# EAGLE schematic PX4FMUv2.4 (EAGLE 6.4)

## Sheet 1 of 12
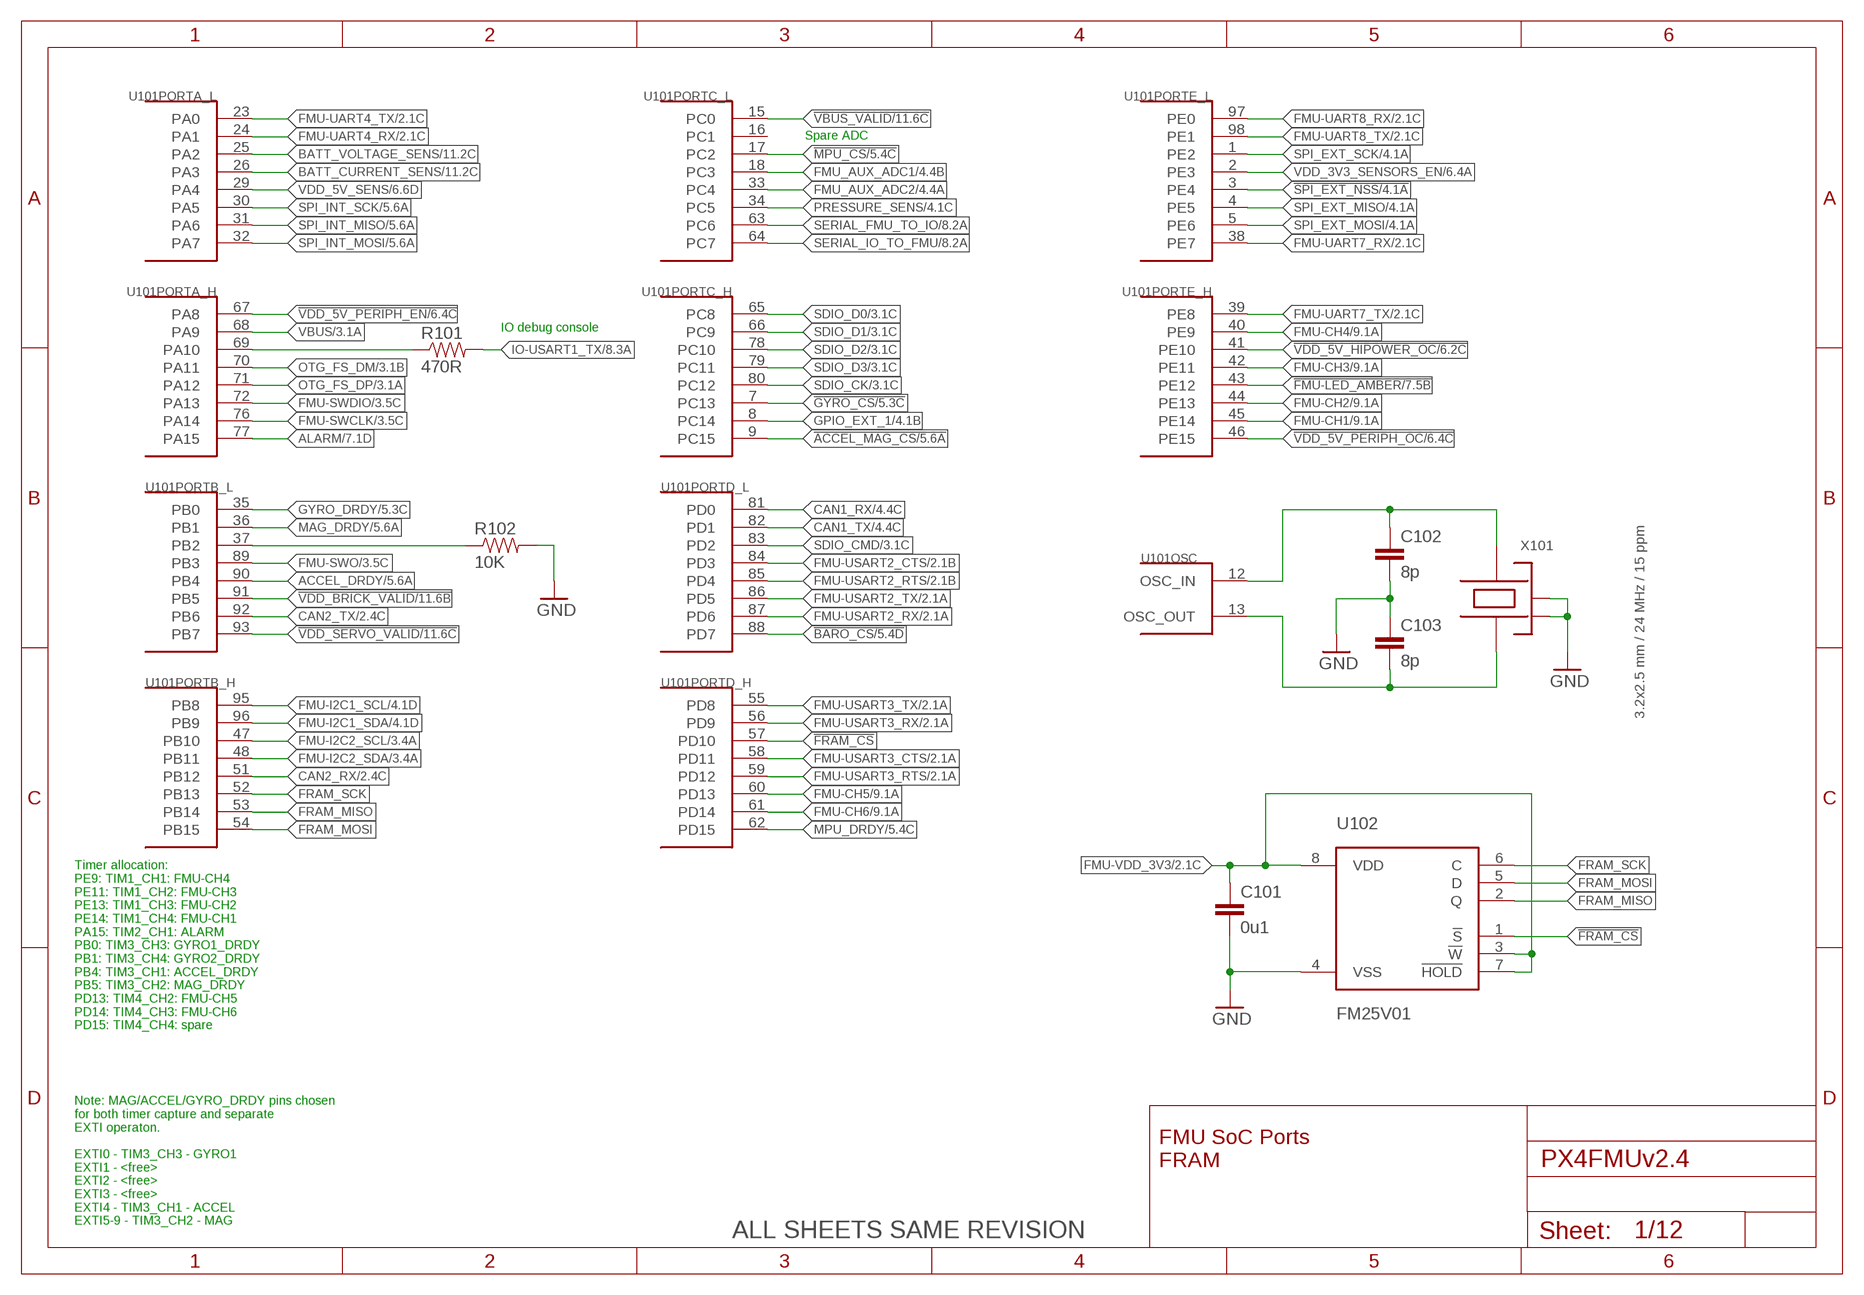
[diagram p0: schematic, sheet 1]

### Parts
C101  0u1  CAP0402  [0402-CAP]
C102  8p  CAP0402  [0402-CAP]
C103  8p  CAP0402  [0402-CAP]
R101  470R  RESISTOR0402-RES  [0402-RES]
R102  10K  RESISTOR0402-RES  [0402-RES]
U101  STM32F4X7VX  [TQFP100]
U102  FM25V01  [SO08]
X101  3.2x2.5 mm / 24 MHz / 15 ppm  OSCILLATOR-3.2X2.5  [OSCILLATOR-3.2X2.5]

### Nets
!ACCEL_MAG_CS: U101.9(PORTC_H:PC15) ; also sheet 5
!BARO_CS: U101.88(PORTD_L:PD7) ; also sheet 5
!FMU-LED_AMBER: U101.43(PORTE_H:PE12) ; also sheet 7
!FRAM_CS: U101.57(PORTD_H:PD10) U102.1(!S)
!GYRO_CS: U101.7(PORTC_H:PC13) ; also sheet 5
!MPU_CS: U101.17(PORTC_L:PC2) ; also sheet 5
!SPI_EXT_NSS: U101.3(PORTE_L:PE4) ; also sheet 4
!VBUS_VALID: U101.15(PORTC_L:PC0) ; also sheet 11,12
!VDD_5V_HIPOWER_OC: U101.41(PORTE_H:PE10) ; also sheet 6
!VDD_5V_PERIPH_EN: U101.67(PORTA_H:PA8) ; also sheet 6
!VDD_5V_PERIPH_OC: U101.46(PORTE_H:PE15) ; also sheet 6
!VDD_BRICK_VALID: U101.91(PORTB_L:PB5) ; also sheet 11,12
!VDD_SERVO_VALID: U101.93(PORTB_L:PB7) ; also sheet 11,12
ACCEL_DRDY: U101.90(PORTB_L:PB4) ; also sheet 5
ALARM: U101.77(PORTA_H:PA15) ; also sheet 7
BATT_CURRENT_SENS: U101.26(PORTA_L:PA3) ; also sheet 11
BATT_VOLTAGE_SENS: U101.25(PORTA_L:PA2) ; also sheet 11
CAN1_RX: U101.81(PORTD_L:PD0) ; also sheet 4
CAN1_TX: U101.82(PORTD_L:PD1) ; also sheet 4
CAN2_RX: U101.51(PORTB_H:PB12) ; also sheet 2
CAN2_TX: U101.92(PORTB_L:PB6) ; also sheet 2
FMU-CH1: U101.45(PORTE_H:PE14) ; also sheet 9
FMU-CH2: U101.44(PORTE_H:PE13) ; also sheet 9
FMU-CH3: U101.42(PORTE_H:PE11) ; also sheet 9
FMU-CH4: U101.40(PORTE_H:PE9) ; also sheet 9
FMU-CH5: U101.60(PORTD_H:PD13) ; also sheet 9
FMU-CH6: U101.61(PORTD_H:PD14) ; also sheet 9
FMU-I2C1_SCL: U101.95(PORTB_H:PB8) ; also sheet 4
FMU-I2C1_SDA: U101.96(PORTB_H:PB9) ; also sheet 4
FMU-I2C2_SCL: U101.47(PORTB_H:PB10) ; also sheet 3,7
FMU-I2C2_SDA: U101.48(PORTB_H:PB11) ; also sheet 3,7
FMU-SWCLK: U101.76(PORTA_H:PA14) ; also sheet 3
FMU-SWDIO: U101.72(PORTA_H:PA13) ; also sheet 3
FMU-SWO: U101.89(PORTB_L:PB3) ; also sheet 3
FMU-UART4_RX: U101.24(PORTA_L:PA1) ; also sheet 2
FMU-UART4_TX: U101.23(PORTA_L:PA0) ; also sheet 2
FMU-UART7_RX: U101.38(PORTE_L:PE7) ; also sheet 2
FMU-UART7_TX: U101.39(PORTE_H:PE8) ; also sheet 2
FMU-UART8_RX: U101.97(PORTE_L:PE0) ; also sheet 2
FMU-UART8_TX: U101.98(PORTE_L:PE1) ; also sheet 2
FMU-USART2_CTS: U101.84(PORTD_L:PD3) ; also sheet 2
FMU-USART2_RTS: U101.85(PORTD_L:PD4) ; also sheet 2
FMU-USART2_RX: U101.87(PORTD_L:PD6) ; also sheet 2
FMU-USART2_TX: U101.86(PORTD_L:PD5) ; also sheet 2
FMU-USART3_CTS: U101.58(PORTD_H:PD11) ; also sheet 2
FMU-USART3_RTS: U101.59(PORTD_H:PD12) ; also sheet 2
FMU-USART3_RX: U101.56(PORTD_H:PD9) ; also sheet 2
FMU-USART3_TX: U101.55(PORTD_H:PD8) ; also sheet 2
FMU-VDD_3V3 [power]: C101.P$1 U102.3(!W) U102.7(!HOLD) U102.8(VDD) ; also sheet 2,3,4,6,7,9,12
FMU_AUX_ADC1: U101.18(PORTC_L:PC3) ; also sheet 4
FMU_AUX_ADC2: U101.33(PORTC_L:PC4) ; also sheet 4
FRAM_MISO: U101.53(PORTB_H:PB14) U102.2(Q)
FRAM_MOSI: U101.54(PORTB_H:PB15) U102.5(D)
FRAM_SCK: U101.52(PORTB_H:PB13) U102.6(C)
GND [power]: C101.P$2 C102.P$2 C103.P$1 R102.P$2 U102.4(VSS) X101.2(NC_2) X101.4(NC_4) ; also sheet 2,3,4,5,6,7,8,9,10,11,12
GPIO_EXT_1: U101.8(PORTC_H:PC14) ; also sheet 4
GYRO_DRDY: U101.35(PORTB_L:PB0) ; also sheet 5
IO-USART1_TX: R101.P$2 ; also sheet 8
MAG_DRDY: U101.36(PORTB_L:PB1) ; also sheet 5
MPU_DRDY [power]: U101.62(PORTD_H:PD15) ; also sheet 5
N$1: C103.P$2 U101.13(OSC:OSC_OUT) X101.1
N$2: C102.P$1 U101.12(OSC:OSC_IN) X101.3
N$23: R101.P$1 U101.69(PORTA_H:PA10)
OTG_FS_DM: U101.70(PORTA_H:PA11) ; also sheet 3
OTG_FS_DP: U101.71(PORTA_H:PA12) ; also sheet 3
PB2-BOOT1: R102.P$1 U101.37(PORTB_L:PB2)
PRESSURE_SENS: U101.34(PORTC_L:PC5) ; also sheet 4
SDIO_CK: U101.80(PORTC_H:PC12) ; also sheet 3
SDIO_CMD: U101.83(PORTD_L:PD2) ; also sheet 3
SDIO_D0: U101.65(PORTC_H:PC8) ; also sheet 3
SDIO_D1: U101.66(PORTC_H:PC9) ; also sheet 3
SDIO_D2: U101.78(PORTC_H:PC10) ; also sheet 3
SDIO_D3: U101.79(PORTC_H:PC11) ; also sheet 3
SERIAL_FMU_TO_IO: U101.63(PORTC_L:PC6) ; also sheet 8
SERIAL_IO_TO_FMU: U101.64(PORTC_L:PC7) ; also sheet 8
SPI_EXT_MISO: U101.4(PORTE_L:PE5) ; also sheet 4
SPI_EXT_MOSI: U101.5(PORTE_L:PE6) ; also sheet 4
SPI_EXT_SCK: U101.1(PORTE_L:PE2) ; also sheet 4
SPI_INT_MISO: U101.31(PORTA_L:PA6) ; also sheet 5
SPI_INT_MOSI: U101.32(PORTA_L:PA7) ; also sheet 5
SPI_INT_SCK: U101.30(PORTA_L:PA5) ; also sheet 5
VBUS [power]: U101.68(PORTA_H:PA9) ; also sheet 3,11,12
VDD_3V3_SENSORS_EN: U101.2(PORTE_L:PE3) ; also sheet 6
VDD_5V_SENS: U101.29(PORTA_L:PA4) ; also sheet 6
Unconnected: U101.16(PORTC_L:PC1)

### Notes on the sheet
- Spare ADC
- IO debug console
- Timer allocation:
  PE9: TIM1_CH1: FMU-CH4
  PE11: TIM1_CH2: FMU-CH3
  PE13: TIM1_CH3: FMU-CH2
  PE14: TIM1_CH4: FMU-CH1
  PA15: TIM2_CH1: ALARM
  PB0: TIM3_CH3: GYRO1_DRDY
  PB1: TIM3_CH4: GYRO2_DRDY
  PB4: TIM3_CH1: ACCEL_DRDY
  PB5: TIM3_CH2: MAG_DRDY
  PD13: TIM4_CH2: FMU-CH5
  PD14: TIM4_CH3: FMU-CH6
  PD15: TIM4_CH4: spare
- FMU SoC Ports
  FRAM
- Note: MAG/ACCEL/GYRO_DRDY pins chosen
  for both timer capture and separate
  EXTI operaton.
  
  EXTI0 - TIM3_CH3 - GYRO1
  EXTI1 - <free>
  EXTI2 - <free>
  EXTI3 - <free>
  EXTI4 - TIM3_CH1 - ACCEL
  EXTI5-9 - TIM3_CH2 - MAG
- ALL SHEETS SAME REVISION

## Sheet 2 of 12
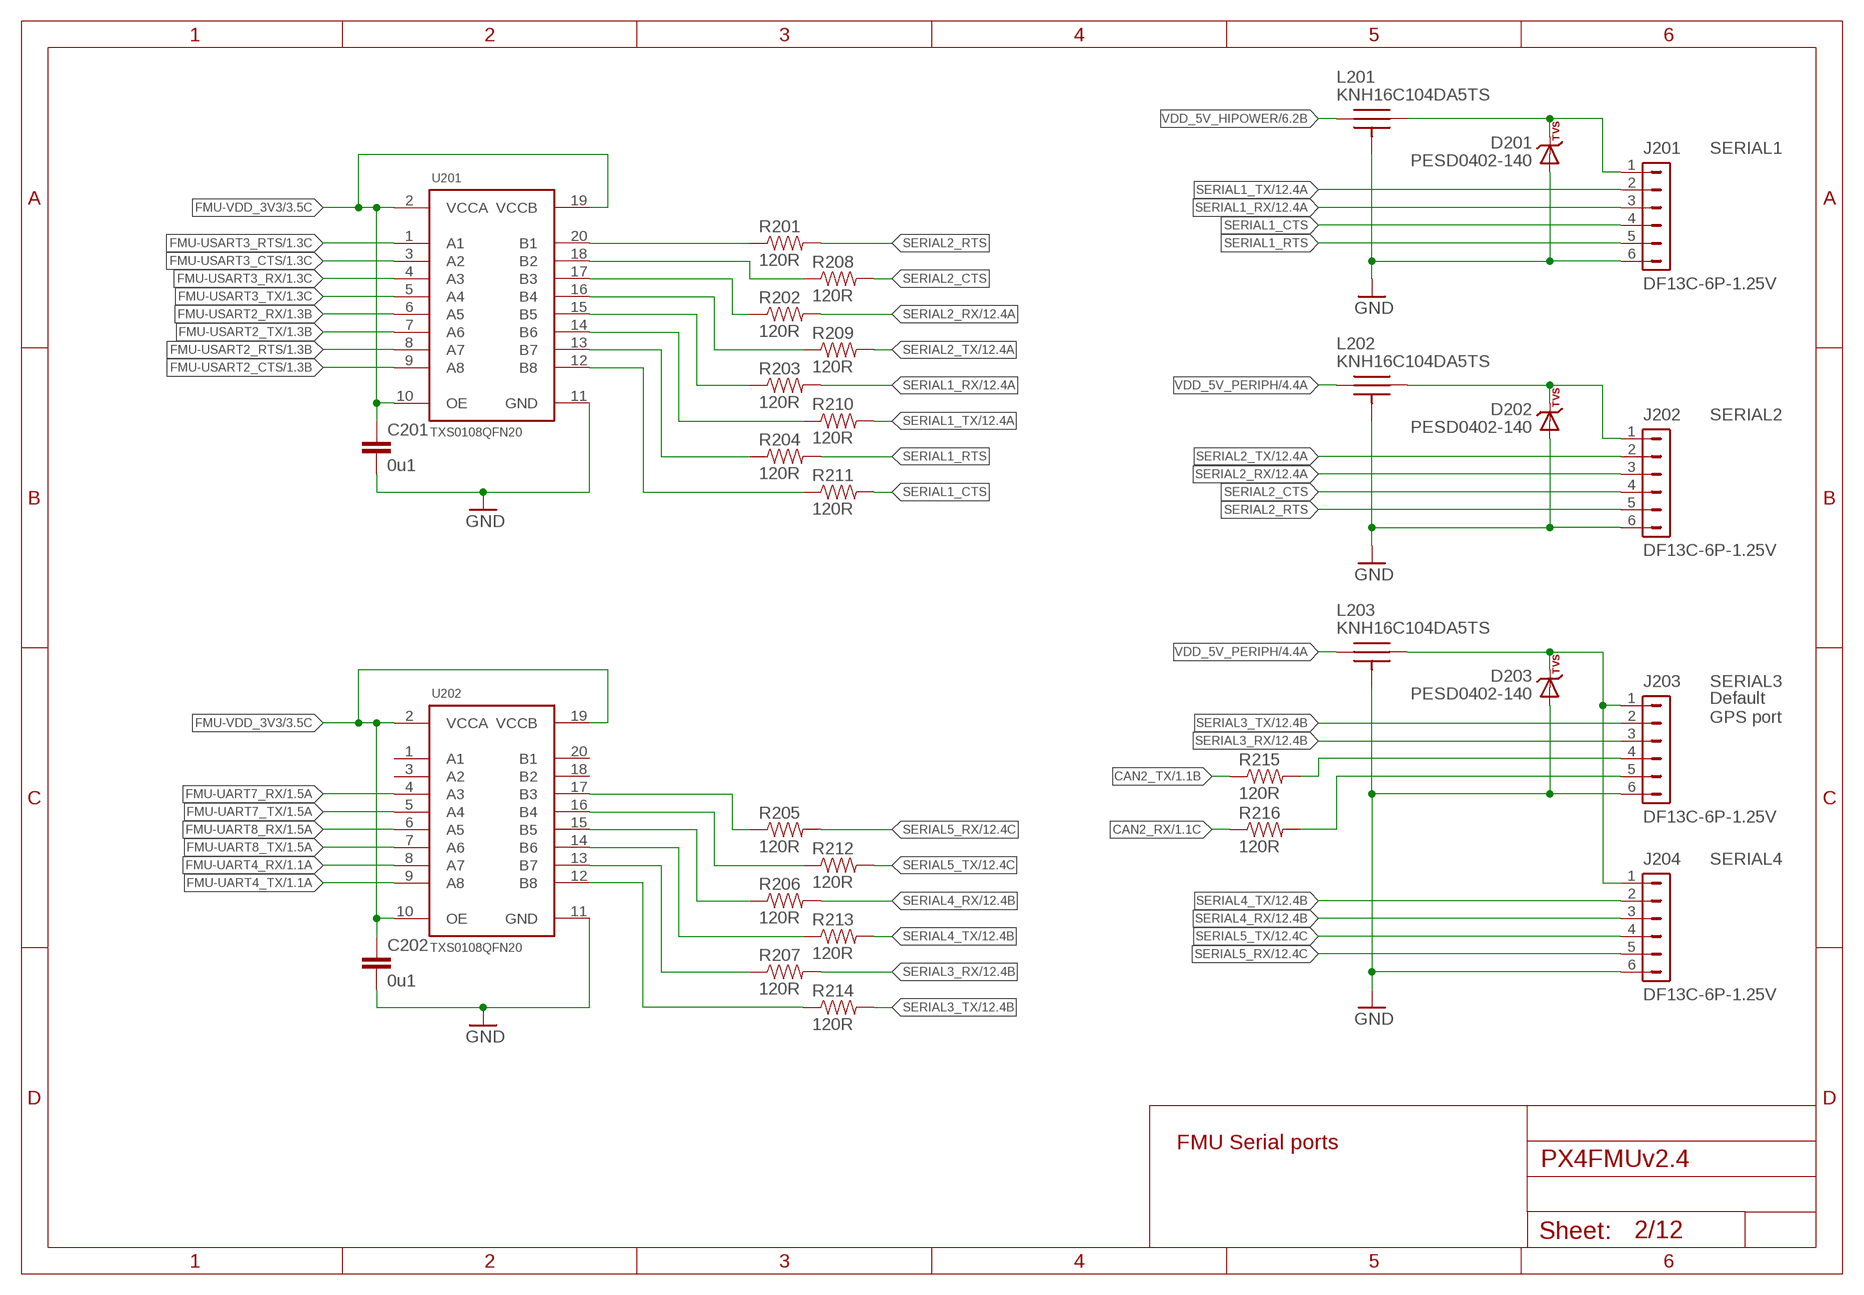
[diagram p1: schematic, sheet 2]

### Parts
C201  0u1  CAP0402  [0402-CAP]
C202  0u1  CAP0402  [0402-CAP]
D201  PESD0402-140  DIODE-TVS  [0402-TVS]
D202  PESD0402-140  DIODE-TVS  [0402-TVS]
D203  PESD0402-140  DIODE-TVS  [0402-TVS]
J201  DF13C-6P-1.25V  DF13-6P-1.25V  [DF13C-6P-1.25V]
J202  DF13C-6P-1.25V  DF13-6P-1.25V  [DF13C-6P-1.25V]
J203  DF13C-6P-1.25V  DF13-6P-1.25V  [DF13C-6P-1.25V]
J204  DF13C-6P-1.25V  DF13-6P-1.25V  [DF13C-6P-1.25V]
L201  KNH16C104DA5TS  [KYOCERA-KNH16-DA]
L202  KNH16C104DA5TS  [KYOCERA-KNH16-DA]
L203  KNH16C104DA5TS  [KYOCERA-KNH16-DA]
R201  120R  RESISTOR0402-RES  [0402-RES]
R202  120R  RESISTOR0402-RES  [0402-RES]
R203  120R  RESISTOR0402-RES  [0402-RES]
R204  120R  RESISTOR0402-RES  [0402-RES]
R205  120R  RESISTOR0402-RES  [0402-RES]
R206  120R  RESISTOR0402-RES  [0402-RES]
R207  120R  RESISTOR0402-RES  [0402-RES]
R208  120R  RESISTOR0402-RES  [0402-RES]
R209  120R  RESISTOR0402-RES  [0402-RES]
R210  120R  RESISTOR0402-RES  [0402-RES]
R211  120R  RESISTOR0402-RES  [0402-RES]
R212  120R  RESISTOR0402-RES  [0402-RES]
R213  120R  RESISTOR0402-RES  [0402-RES]
R214  120R  RESISTOR0402-RES  [0402-RES]
R215  120R  RESISTOR0402-RES  [0402-RES]
R216  120R  RESISTOR0402-RES  [0402-RES]
U201  TXS0108QFN20  [QFN20-RGY]
U202  TXS0108QFN20  [QFN20-RGY]

### Nets
CAN2_RX: R216.P$1 ; also sheet 1
CAN2_TX: R215.P$1 ; also sheet 1
FMU-UART4_RX: U202.8(A7) ; also sheet 1
FMU-UART4_TX: U202.9(A8) ; also sheet 1
FMU-UART7_RX: U202.4(A3) ; also sheet 1
FMU-UART7_TX: U202.5(A4) ; also sheet 1
FMU-UART8_RX: U202.6(A5) ; also sheet 1
FMU-UART8_TX: U202.7(A6) ; also sheet 1
FMU-USART2_CTS: U201.9(A8) ; also sheet 1
FMU-USART2_RTS: U201.8(A7) ; also sheet 1
FMU-USART2_RX: U201.6(A5) ; also sheet 1
FMU-USART2_TX: U201.7(A6) ; also sheet 1
FMU-USART3_CTS: U201.3(A2) ; also sheet 1
FMU-USART3_RTS: U201.1(A1) ; also sheet 1
FMU-USART3_RX: U201.4(A3) ; also sheet 1
FMU-USART3_TX: U201.5(A4) ; also sheet 1
FMU-VDD_3V3 [power]: C201.P$1 C202.P$1 U201.2(VCCA) U201.10(OE) U201.19(VCCB) U202.2(VCCA) U202.10(OE) U202.19(VCCB) ; also sheet 1,3,4,6,7,9,12
GND [power]: C201.P$2 C202.P$2 D201.A D202.A D203.A J201.6 J202.6 J203.6 J204.6 L201.P$3 L201.P$4 L201.P$5 L202.P$3 L202.P$4 L202.P$5 L203.P$3 L203.P$4 L203.P$5 U201.11(GND) U202.11(GND) ; also sheet 1,3,4,5,6,7,8,9,10,11,12
N$5 [power]: D201.C J201.1 L201.P$2
N$14: J203.4 R215.P$2
N$19: J203.5 R216.P$2
N$70: R201.P$1 U201.20(B1)
N$82: R208.P$1 U201.18(B2)
N$83: R202.P$1 U201.17(B3)
N$84: R209.P$1 U201.16(B4)
N$85: R203.P$1 U201.15(B5)
N$86: R210.P$1 U201.14(B6)
N$87: R204.P$1 U201.13(B7)
N$88: R211.P$1 U201.12(B8)
N$89: R207.P$1 U202.13(B7)
N$90: R214.P$1 U202.12(B8)
N$91: R205.P$1 U202.17(B3)
N$92: R212.P$1 U202.16(B4)
N$93: R206.P$1 U202.15(B5)
N$94: R213.P$1 U202.14(B6)
N$100 [power]: D203.C J203.1 J204.1 L203.P$2
N$101 [power]: D202.C J202.1 L202.P$2
SERIAL1_CTS: J201.4 R211.P$2
SERIAL1_RTS: J201.5 R204.P$2
SERIAL1_RX: J201.3 R203.P$2 ; also sheet 12
SERIAL1_TX: J201.2 R210.P$2 ; also sheet 12
SERIAL2_CTS: J202.4 R208.P$2
SERIAL2_RTS: J202.5 R201.P$2
SERIAL2_RX: J202.3 R202.P$2 ; also sheet 12
SERIAL2_TX: J202.2 R209.P$2 ; also sheet 12
SERIAL3_RX: J203.3 R207.P$2 ; also sheet 12
SERIAL3_TX: J203.2 R214.P$2 ; also sheet 12
SERIAL4_RX: J204.3 R206.P$2 ; also sheet 12
SERIAL4_TX: J204.2 R213.P$2 ; also sheet 12
SERIAL5_RX: J204.5 R205.P$2 ; also sheet 12
SERIAL5_TX: J204.4 R212.P$2 ; also sheet 12
VDD_5V_HIPOWER [power]: L201.P$1 ; also sheet 6
VDD_5V_PERIPH [power]: L202.P$1 L203.P$1 ; also sheet 4,6
Unconnected: U202.1(A1) U202.3(A2) U202.18(B2) U202.20(B1)

### Notes on the sheet
- SERIAL1
- SERIAL2
- SERIAL3
- Default 
  GPS port
- SERIAL4
- FMU Serial ports

## Sheet 3 of 12
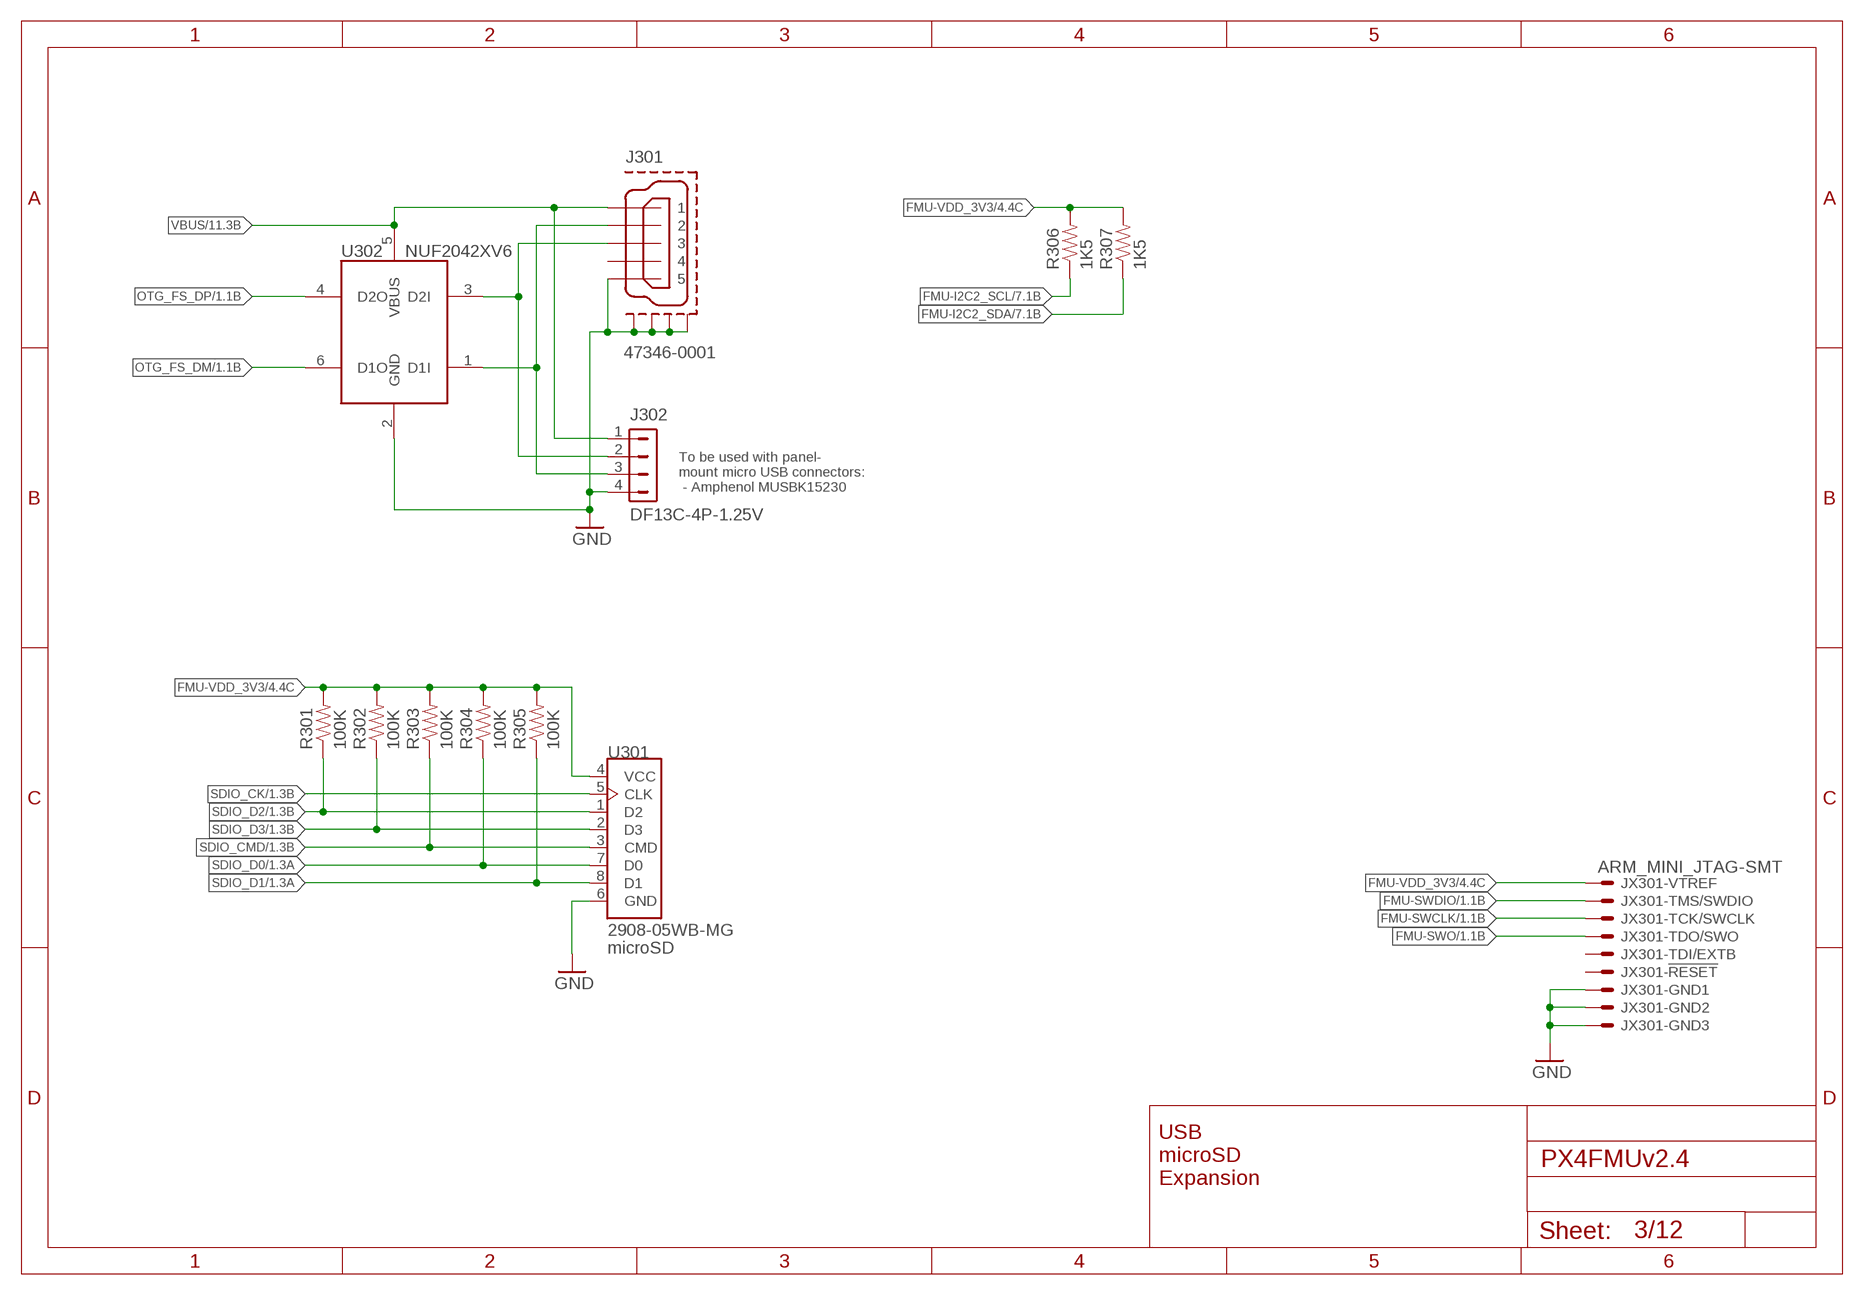
[diagram p2: schematic, sheet 3]

### Parts
J301  47346-0001  MOLEX-47346-0001  [MOLEX-47346-0001]
J302  DF13C-4P-1.25V  DF13-4P-1.25V  [DF13C-4P-1.25V]
JX301  ARM_MINI_JTAG-SMT  [FTSH-105-01-XXX-DV-K]
R301  100K  RESISTOR0402-RES  [0402-RES]
R302  100K  RESISTOR0402-RES  [0402-RES]
R303  100K  RESISTOR0402-RES  [0402-RES]
R304  100K  RESISTOR0402-RES  [0402-RES]
R305  100K  RESISTOR0402-RES  [0402-RES]
R306  1K5  RESISTOR0402-RES  [0402-RES]
R307  1K5  RESISTOR0402-RES  [0402-RES]
U301  2908-05WB-MG  MICROSDSDI  [MICROSD]
U302  NUF2042XV6  [SOT563-6]

### Nets
FMU-I2C2_SCL: R306.P$1 ; also sheet 1,7
FMU-I2C2_SDA: R307.P$1 ; also sheet 1,7
FMU-SWCLK: JX301.4 ; also sheet 1
FMU-SWDIO: JX301.2 ; also sheet 1
FMU-SWO: JX301.6 ; also sheet 1
FMU-VDD_3V3 [power]: JX301.1 R301.P$2 R302.P$2 R303.P$2 R304.P$2 R305.P$2 R306.P$2 R307.P$2 U301.4(VCC) ; also sheet 1,2,4,6,7,9,12
GND [power]: J301.GND J301.GND1 J301.GND2 J301.GND3 J301.GND4 J302.4 JX301.3 JX301.5 JX301.9 U301.6(GND) U302.2(GND) ; also sheet 1,2,4,5,6,7,8,9,10,11,12
OTG_DM1: J301.D- J302.3 U302.1(D1I)
OTG_DP1: J301.D+ J302.2 U302.3(D2I)
OTG_FS_DM: U302.6(D1O) ; also sheet 1
OTG_FS_DP: U302.4(D2O) ; also sheet 1
SDIO_CK: U301.5(CLK) ; also sheet 1
SDIO_CMD: R303.P$1 U301.3(CMD) ; also sheet 1
SDIO_D0: R304.P$1 U301.7(D0) ; also sheet 1
SDIO_D1: R305.P$1 U301.8(D1) ; also sheet 1
SDIO_D2: R301.P$1 U301.1(D2) ; also sheet 1
SDIO_D3: R302.P$1 U301.2(D3) ; also sheet 1
VBUS [power]: J301.VBUS J302.1 U302.5(VBUS) ; also sheet 1,11,12
Unconnected: J301.ID JX301.8 JX301.10

### Notes on the sheet
- To be used with panel-
  mount micro USB connectors:
   - Amphenol MUSBK15230
- microSD
- USB
  microSD
  Expansion

## Sheet 4 of 12
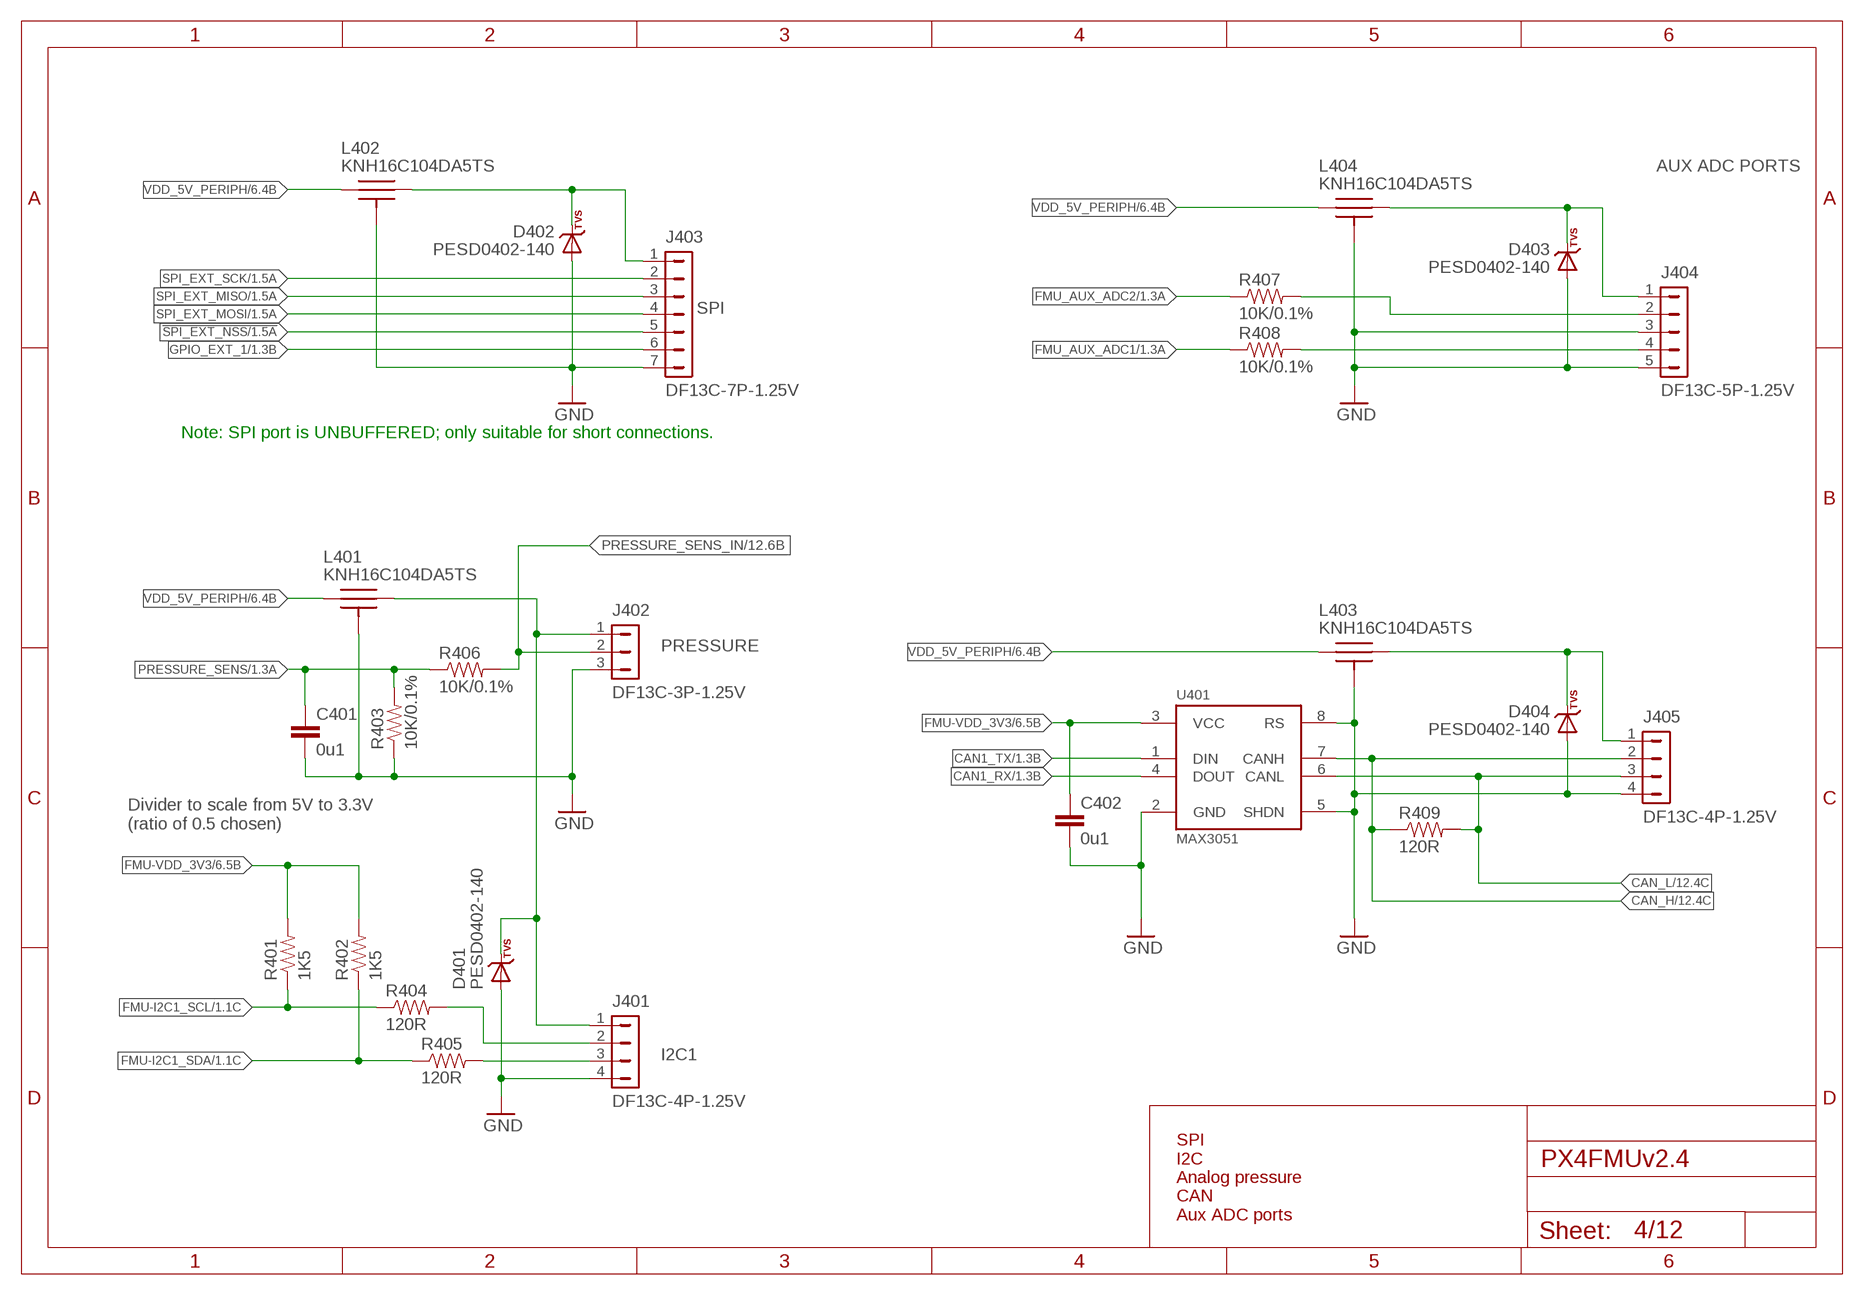
[diagram p3: schematic, sheet 4]

### Parts
C401  0u1  CAP0402  [0402-CAP]
C402  0u1  CAP0402  [0402-CAP]
D401  PESD0402-140  DIODE-TVS  [0402-TVS]
D402  PESD0402-140  DIODE-TVS  [0402-TVS]
D403  PESD0402-140  DIODE-TVS  [0402-TVS]
D404  PESD0402-140  DIODE-TVS  [0402-TVS]
J401  DF13C-4P-1.25V  DF13-4P-1.25V  [DF13C-4P-1.25V]
J402  DF13C-3P-1.25V  DF13-3P-1.25V  [DF13C-3P-1.25V]
J403  DF13C-7P-1.25V  DF13-7P-1.25V  [DF13C-7P-1.25V]
J404  DF13C-5P-1.25V  DF13-5P-1.25V  [DF13C-5P-1.25V]
J405  DF13C-4P-1.25V  DF13-4P-1.25V  [DF13C-4P-1.25V]
L401  KNH16C104DA5TS  [KYOCERA-KNH16-DA]
L402  KNH16C104DA5TS  [KYOCERA-KNH16-DA]
L403  KNH16C104DA5TS  [KYOCERA-KNH16-DA]
L404  KNH16C104DA5TS  [KYOCERA-KNH16-DA]
R401  1K5  RESISTOR0402-RES  [0402-RES]
R402  1K5  RESISTOR0402-RES  [0402-RES]
R403  10K/0.1%  RESISTOR0402-RES  [0402-RES]
R404  120R  RESISTOR0402-RES  [0402-RES]
R405  120R  RESISTOR0402-RES  [0402-RES]
R406  10K/0.1%  RESISTOR0402-RES  [0402-RES]
R407  10K/0.1%  RESISTOR0402-RES  [0402-RES]
R408  10K/0.1%  RESISTOR0402-RES  [0402-RES]
R409  120R  RESISTOR0402-RES  [0402-RES]
U401  MAX3051  MAX3051MAX3051EKA  [SOT23-8]

### Nets
!SPI_EXT_NSS: J403.5 ; also sheet 1
CAN1_RX: U401.4(DOUT) ; also sheet 1
CAN1_TX: U401.1(DIN) ; also sheet 1
CAN_H: J405.2 R409.P$1 U401.7(CANH) ; also sheet 12
CAN_L: J405.3 R409.P$2 U401.6(CANL) ; also sheet 12
FMU-I2C1_SCL: R401.P$1 R404.P$1 ; also sheet 1
FMU-I2C1_SDA: R402.P$1 R405.P$1 ; also sheet 1
FMU-VDD_3V3 [power]: C402.P$1 R401.P$2 R402.P$2 U401.3(VCC) ; also sheet 1,2,3,6,7,9,12
FMU_AUX_ADC1: R408.P$1 ; also sheet 1
FMU_AUX_ADC1_PROT: J404.4 R408.P$2
FMU_AUX_ADC2: R407.P$1 ; also sheet 1
FMU_AUX_ADC2_PROT: J404.2 R407.P$2
GND [power]: C401.P$2 C402.P$2 D401.A D402.A D403.A D404.A J401.4 J402.3 J403.7 J404.3 J404.5 J405.4 L401.P$3 L401.P$4 L401.P$5 L402.P$3 L402.P$4 L402.P$5 L403.P$3 L403.P$4 L403.P$5 L404.P$3 L404.P$4 L404.P$5 R403.P$1 U401.2(GND) U401.5(SHDN) U401.8(RS) ; also sheet 1,2,3,5,6,7,8,9,10,11,12
GPIO_EXT_1: J403.6 ; also sheet 1
N$33: J401.2 R404.P$2
N$37: J401.3 R405.P$2
N$41 [power]: D402.C J403.1 L402.P$2
N$42 [power]: D401.C J401.1 J402.1 L401.P$2
N$48 [power]: D404.C J405.1 L403.P$2
N$98 [power]: D403.C J404.1 L404.P$2
PRESSURE_SENS: C401.P$1 R403.P$2 R406.P$1 ; also sheet 1
PRESSURE_SENS_IN: J402.2 R406.P$2 ; also sheet 12
SPI_EXT_MISO: J403.3 ; also sheet 1
SPI_EXT_MOSI: J403.4 ; also sheet 1
SPI_EXT_SCK: J403.2 ; also sheet 1
VDD_5V_PERIPH [power]: L401.P$1 L402.P$1 L403.P$1 L404.P$1 ; also sheet 2,6

### Notes on the sheet
- AUX ADC PORTS
- SPI
- Note: SPI port is UNBUFFERED; only suitable for short connections.
- PRESSURE
- Divider to scale from 5V to 3.3V
  (ratio of 0.5 chosen)
- I2C1
- SPI
  I2C
  Analog pressure
  CAN
  Aux ADC ports

## Sheet 5 of 12
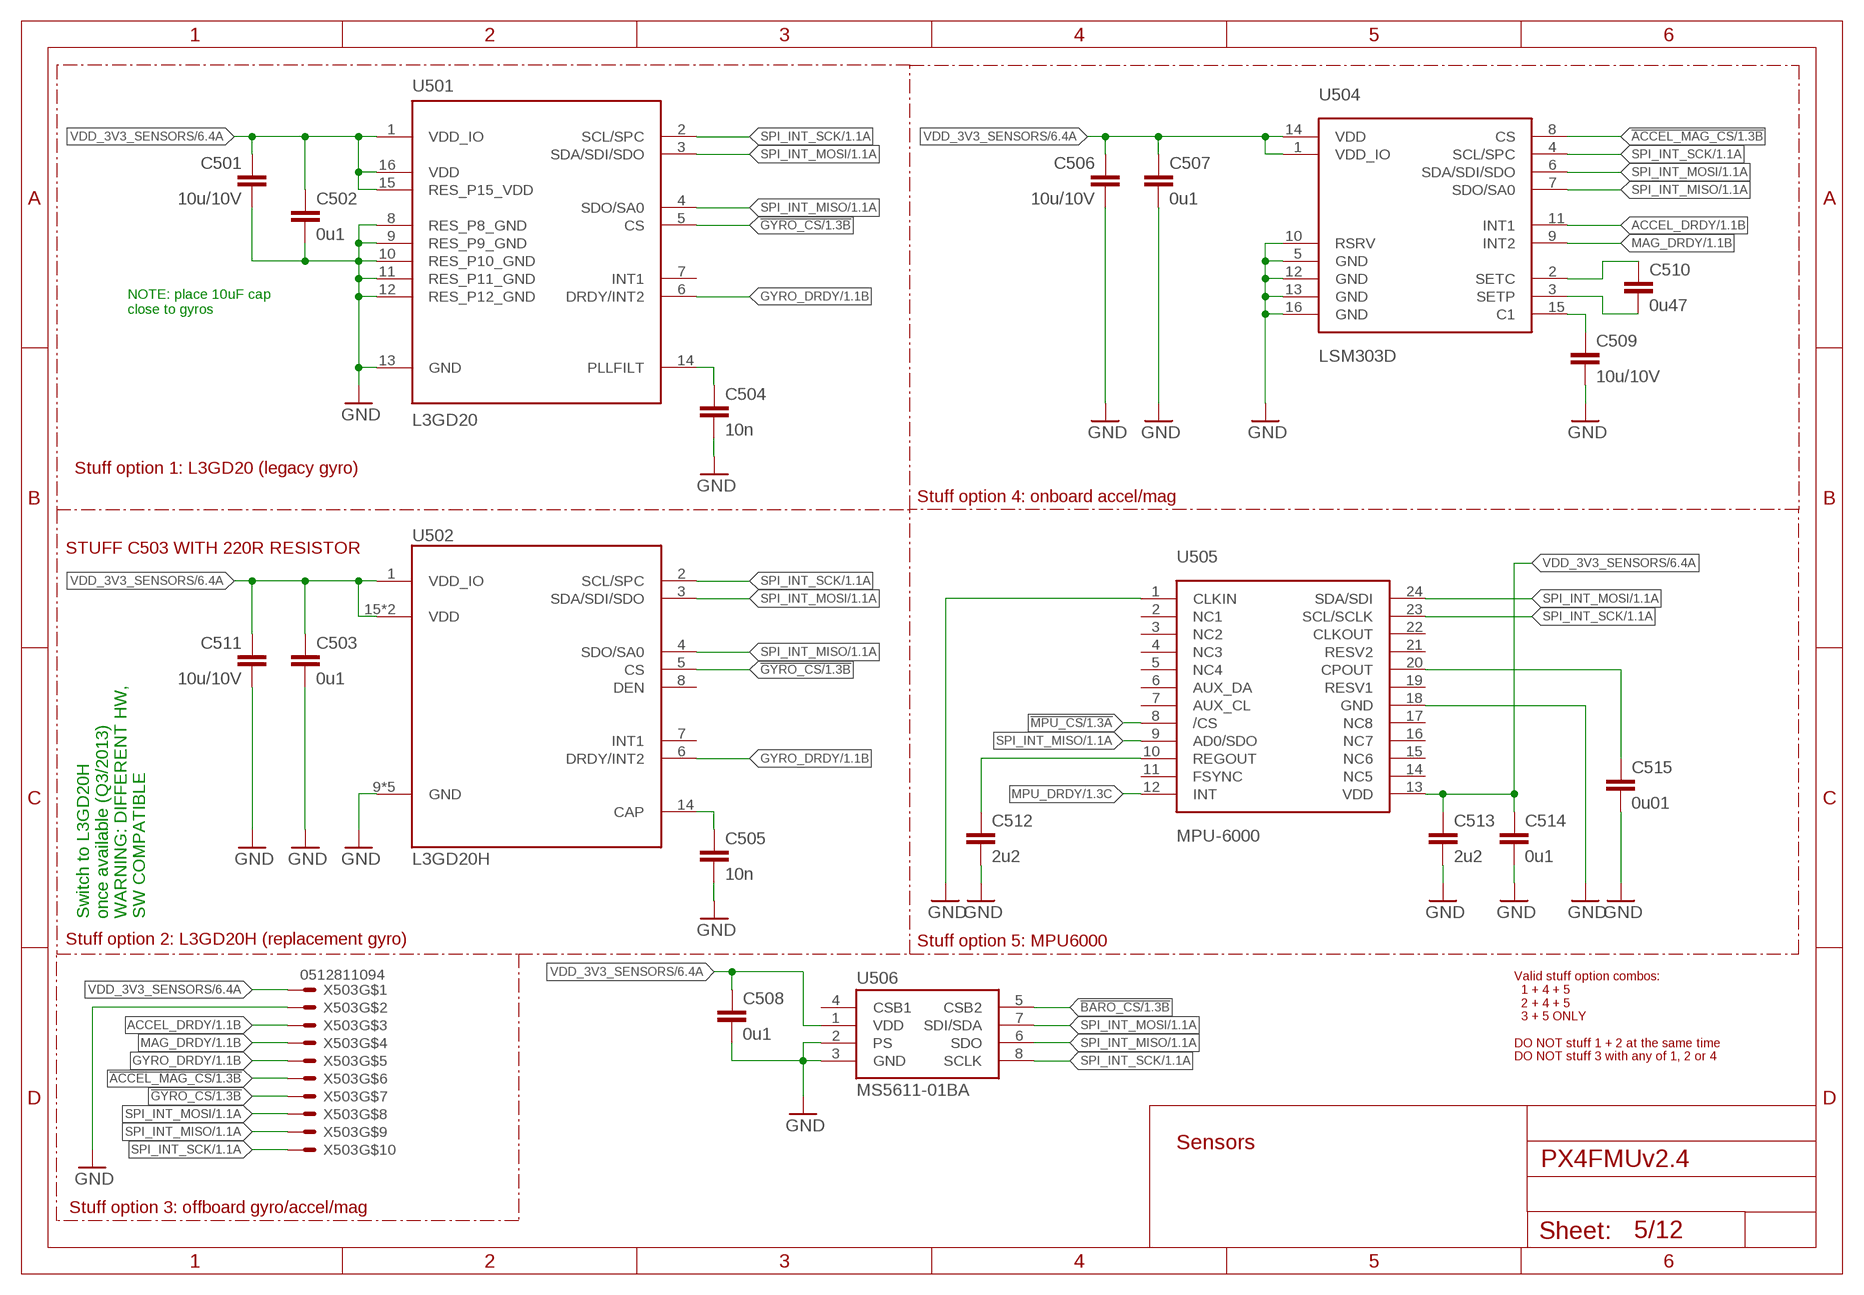
[diagram p4: schematic, sheet 5]

### Parts
C501  10u/10V  CAP0805  [0805-CAP]
C502  0u1  CAP0402  [0402-CAP]
C503  0u1  CAP0402  [0402-CAP]
C504  10n  CAP0402  [0402-CAP]
C505  10n  CAP0402  [0402-CAP]
C506  10u/10V  CAP0805  [0805-CAP]
C507  0u1  CAP0402  [0402-CAP]
C508  0u1  CAP0402  [0402-CAP]
C509  10u/10V  CAP0805  [0805-CAP]
C510  0u47  CAP0402  [0402-CAP]
C511  10u/10V  CAP0805  [0805-CAP]
C512  2u2  CAP0603  [0603-CAP]
C513  2u2  CAP0603  [0603-CAP]
C514  0u1  CAP0402  [0402-CAP]
C515  0u01  CAP0603  [0603-CAP]
U501  L3GD20  L3G4200DH-LL  [L3G4200DH-MAN]
U502  L3GD20H  [LGA-16L]
U504  LSM303D  [LGA-16L]
U505  MPU-6000  [QFN-24]
U506  MS5611-01BA  [MS5611-01BA]
X503  0512811094  CONN_FPC_10RA  [51281-1094]

### Nets
!ACCEL_MAG_CS: U504.8(CS) X503.6 ; also sheet 1
!BARO_CS: U506.5(CSB2) ; also sheet 1
!GYRO_CS: U501.5(CS) U502.5(CS) X503.7 ; also sheet 1
!MPU_CS: U505.8(/CS) ; also sheet 1
ACCEL_DRDY: U504.11(INT1) X503.3 ; also sheet 1
GND [power]: C501.P$2 C502.P$2 C503.P$2 C504.P$2 C505.P$2 C506.P$2 C507.P$2 C508.P$2 C509.P$2 C511.P$2 C512.P$2 C513.P$2 C514.P$2 C515.P$2 U501.8(RES_P8_GND) U501.9(RES_P9_GND) U501.10(RES_P10_GND) U501.11(RES_P11_GND) U501.12(RES_P12_GND) U501.13(GND) U502.9(GND) U502.10(GND) U502.11(GND) U502.12(GND) U502.13(GND) U504.5(GND) U504.10(RSRV) U504.12(GND) U504.13(GND) U504.16(GND) U505.1(CLKIN) U505.18(GND) U506.2(PS) U506.3(GND) X503.2 ; also sheet 1,2,3,4,6,7,8,9,10,11,12
GYRO_DRDY: U501.6(DRDY/INT2) U502.6(DRDY/INT2) X503.5 ; also sheet 1
MAG_DRDY: U504.9(INT2) X503.4 ; also sheet 1
MPU_DRDY [power]: U505.12(INT) ; also sheet 1
N$6: C509.P$1 U504.15(C1)
N$10: C510.P$1 U504.2(SETC)
N$17: C510.P$2 U504.3(SETP)
N$30: C505.P$1 U502.14(CAP)
N$35: C504.P$1 U501.14(PLLFILT)
N$50: C512.P$1 U505.10(REGOUT)
N$51: C515.P$1 U505.20(CPOUT)
SPI_INT_MISO: U501.4(SDO/SA0) U502.4(SDO/SA0) U504.7(SDO/SA0) U505.9(AD0/SDO) U506.6(SDO) X503.9 ; also sheet 1
SPI_INT_MOSI: U501.3(SDA/SDI/SDO) U502.3(SDA/SDI/SDO) U504.6(SDA/SDI/SDO) U505.24(SDA/SDI) U506.7(SDI/SDA) X503.8 ; also sheet 1
SPI_INT_SCK: U501.2(SCL/SPC) U502.2(SCL/SPC) U504.4(SCL/SPC) U505.23(SCL/SCLK) U506.8(SCLK) X503.10 ; also sheet 1
VDD_3V3_SENSORS [power]: C501.P$1 C502.P$1 C503.P$1 C506.P$1 C507.P$1 C508.P$1 C511.P$1 C513.P$1 C514.P$1 U501.1(VDD_IO) U501.15(RES_P15_VDD) U501.16(VDD) U502.1(VDD_IO) U502.15(VDD) U502.16(VDD) U504.1(VDD_IO) U504.14(VDD) U505.13(VDD) U506.1(VDD) X503.1 ; also sheet 6,12
Unconnected: U501.7(INT1) U502.7(INT1) U502.8(DEN) U505.2(NC1) U505.3(NC2) U505.4(NC3) U505.5(NC4) U505.6(AUX_DA) U505.7(AUX_CL) U505.11(FSYNC) U505.14(NC5) U505.15(NC6) U505.16(NC7) U505.17(NC8) U505.19(RESV1) U505.21(RESV2) U505.22(CLKOUT) U506.4(CSB1)

### Notes on the sheet
- NOTE: place 10uF cap
  close to gyros
- Stuff option 1: L3GD20 (legacy gyro)
- Stuff option 4: onboard accel/mag
- STUFF C503 WITH 220R RESISTOR
- Switch to L3GD20H
  once available (Q3/2013)
  WARNING: DIFFERENT HW,
  SW COMPATIBLE
- Stuff option 2: L3GD20H (replacement gyro) | Stuff option 5: MPU6000
- Valid stuff option combos:
    1 + 4 + 5
    2 + 4 + 5
    3 + 5 ONLY
  
  DO NOT stuff 1 + 2 at the same time
  DO NOT stuff 3 with any of 1, 2 or 4
- Sensors
- Stuff option 3: offboard gyro/accel/mag

## Sheet 6 of 12
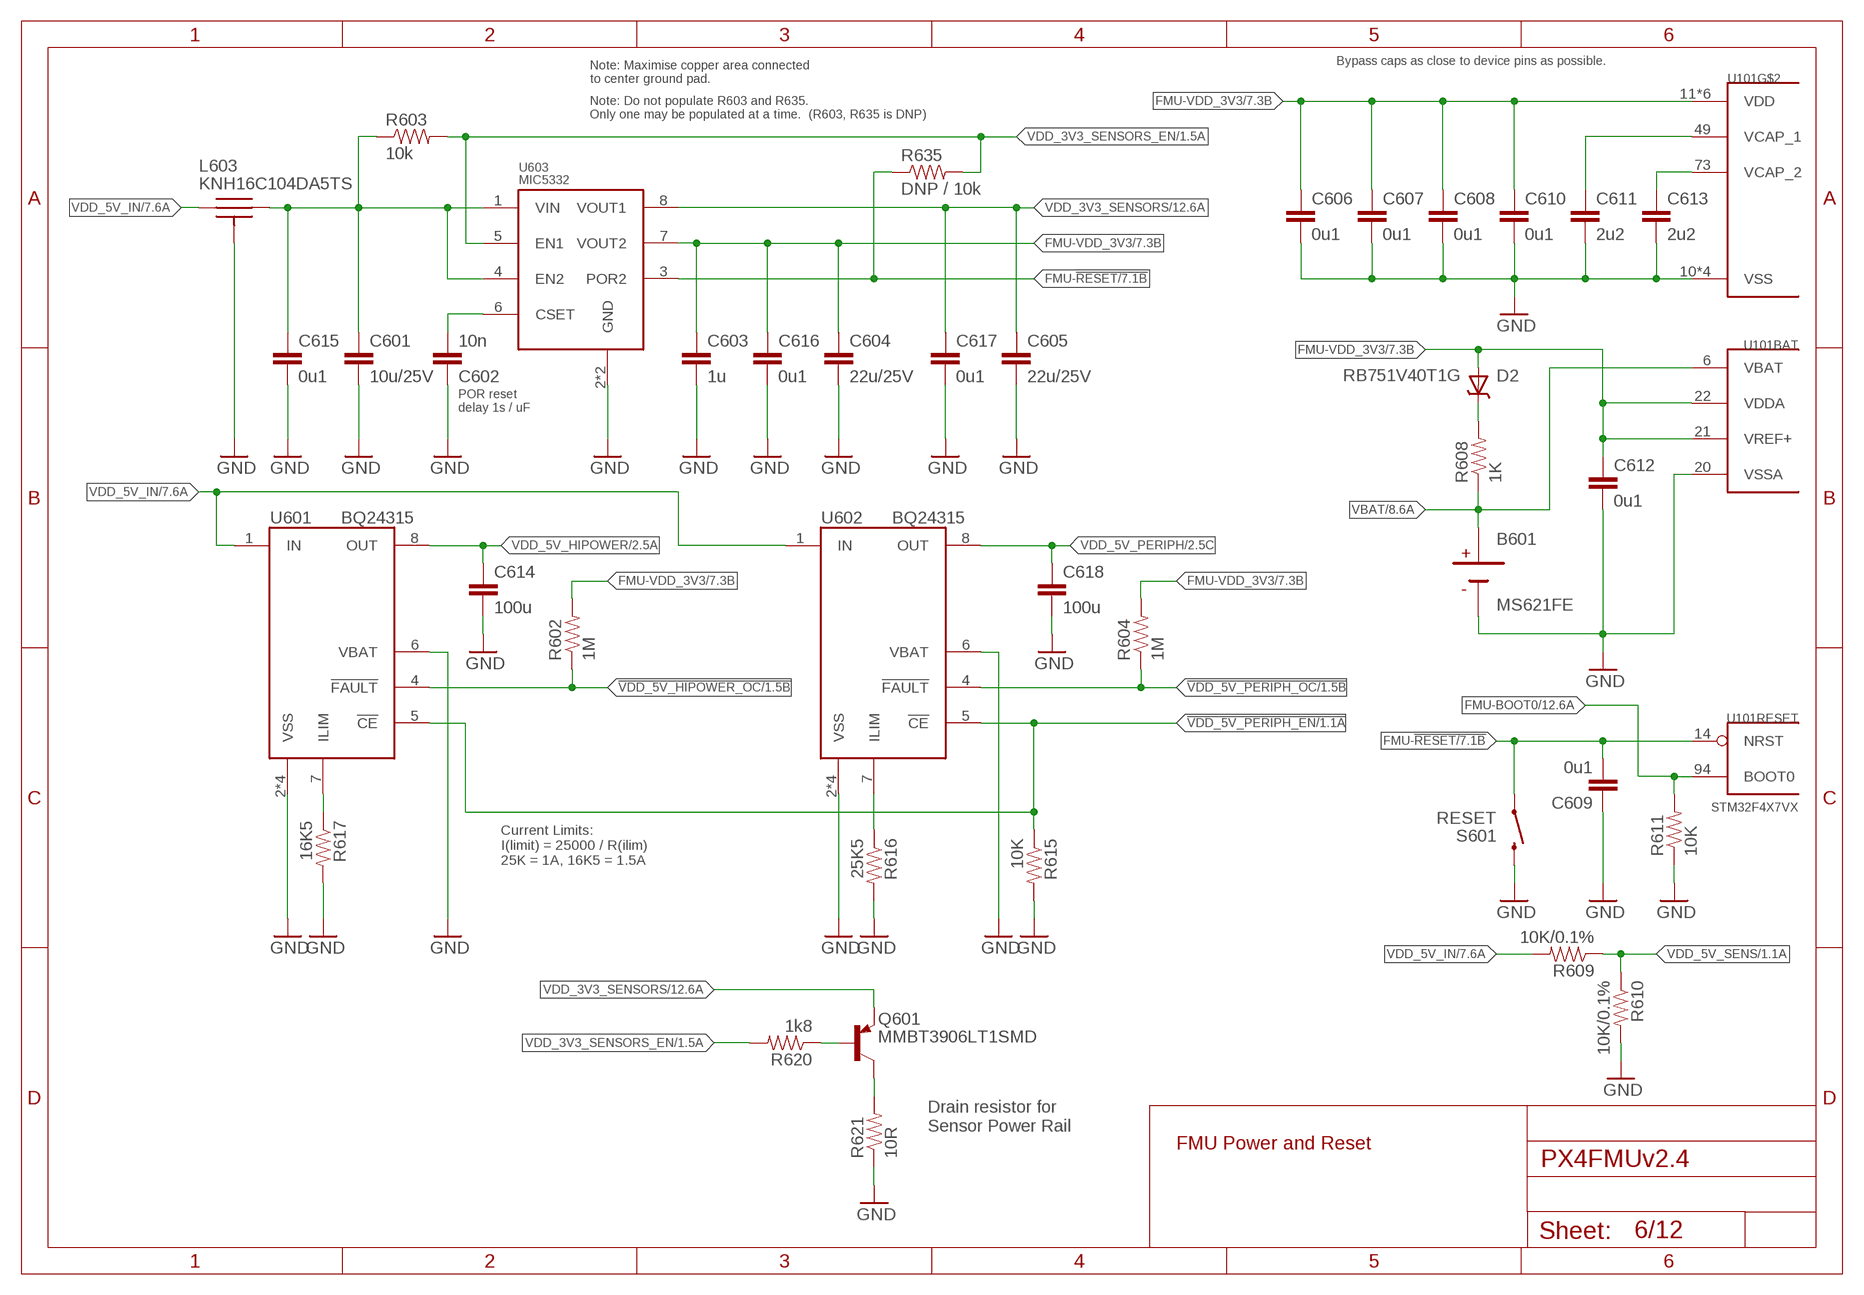
[diagram p5: schematic, sheet 6]

### Parts
B601  MS621FE  [MS621FE]
C601  10u/25V  CAP0805  [0805-CAP]
C602  10n  CAP0402  [0402-CAP]
C603  1u  CAP0603  [0603-CAP]
C604  22u/25V  CAP0805  [0805-CAP]
C605  22u/25V  CAP0805  [0805-CAP]
C606  0u1  CAP0402  [0402-CAP]
C607  0u1  CAP0402  [0402-CAP]
C608  0u1  CAP0402  [0402-CAP]
C609  0u1  CAP0402  [0402-CAP]
C610  0u1  CAP0402  [0402-CAP]
C611  2u2  CAP0603  [0603-CAP]
C612  0u1  CAP0402  [0402-CAP]
C613  2u2  CAP0603  [0603-CAP]
C614  100u  CAP1206  [1206-CAP]
C615  0u1  CAP0402  [0402-CAP]
C616  0u1  CAP0402  [0402-CAP]
C617  0u1  CAP0402  [0402-CAP]
C618  100u  CAP1206  [1206-CAP]
D2  RB751V40T1G  DIODE-SCHOTTKY_SOD323  [SOD323]
L603  KNH16C104DA5TS  [KYOCERA-KNH16-DA]
Q601  MMBT3906LT1SMD  [SOT23-BEC]
R602  1M  RESISTOR0402-RES  [0402-RES]
R603  10k  RESISTOR0402-RES  [0402-RES]
R604  1M  RESISTOR0402-RES  [0402-RES]
R608  1K  RESISTOR0402-RES  [0402-RES]
R609  10K/0.1%  RESISTOR0402-RES  [0402-RES]
R610  10K/0.1%  RESISTOR0402-RES  [0402-RES]
R611  10K  RESISTOR0402-RES  [0402-RES]
R615  10K  RESISTOR0402-RES  [0402-RES]
R616  25K5  RESISTOR0402-RES  [0402-RES]
R617  16K5  RESISTOR0402-RES  [0402-RES]
R620  1k8  RESISTOR0402-RES  [0402-RES]
R621  10R  RESISTOR0603-RES  [0603-RES]
R635  DNP / 10k  RESISTOR0402-RES  [0402-RES]
S601  RESET  SWITCH-MOMENTARY-2  [EVQP7J01K]
U601  BQ24315  [QFN8-DSG]
U602  BQ24315  [QFN8-DSG]
U603  MIC5332  [MLF-8-EPAD]

### Nets
!VDD_5V_HIPOWER_OC: R602.P$1 U601.4(!FAULT) ; also sheet 1
!VDD_5V_PERIPH_EN: R615.P$1 U601.5(!CE) U602.5(!CE) ; also sheet 1
!VDD_5V_PERIPH_OC: R604.P$1 U602.4(!FAULT) ; also sheet 1
FMU-!RESET: C609.P$2 R635.P$1 S601.A1 U101.14(RESET:NRST) U603.3(POR2) ; also sheet 7
FMU-BOOT0: R611.P$2 U101.94(RESET:BOOT0) ; also sheet 12
FMU-VDD_3V3 [power]: C603.P$1 C604.P$1 C606.P$1 C607.P$1 C608.P$1 C610.P$1 C612.P$1 C616.P$1 D2.A R602.P$2 R604.P$2 U101.11(VDD) U101.19(VDD) U101.21(BAT:VREF+) U101.22(BAT:VDDA) U101.28(VDD) U101.50(VDD) U101.75(VDD) U101.100(VDD) U603.7(VOUT2) ; also sheet 1,2,3,4,7,9,12
FMU-VDD_5V5 [power]: C601.P$1 C615.P$1 L603.P$2 R603.P$1 U603.1(VIN) U603.4(EN2)
GND [power]: B601.2(NEG) C601.P$2 C602.P$1 C603.P$2 C604.P$2 C605.P$2 C606.P$2 C607.P$2 C608.P$2 C609.P$1 C610.P$2 C611.P$2 C612.P$2 C613.P$2 C614.P$2 C615.P$2 C616.P$2 C617.P$2 C618.P$2 L603.P$3 L603.P$4 L603.P$5 R610.P$2 R611.P$1 R615.P$2 R616.P$2 R617.P$2 R621.1 S601.B3 U101.10(VSS) U101.20(BAT:VSSA) U101.27(VSS) U101.74(VSS) U101.99(VSS) U601.2(VSS) U601.6(VBAT) U601.GND(VSS) U601.P$2(VSS) U601.P$3(VSS) U602.2(VSS) U602.6(VBAT) U602.GND(VSS) U602.P$2(VSS) U602.P$3(VSS) U603.2(GND) U603.GND ; also sheet 1,2,3,4,5,7,8,9,10,11,12
N$8: C613.P$1 U101.73(VCAP_2)
N$11: C602.P$2 U603.6(CSET)
N$12: C611.P$1 U101.49(VCAP_1)
N$21: D2.C R608.P$2
N$34: R616.P$1 U602.7(ILIM)
N$80: Q601.C R621.2
N$81: Q601.B R620.P$1
N$96: R617.P$1 U601.7(ILIM)
VBAT: B601.1(POS) R608.P$1 U101.6(BAT:VBAT) ; also sheet 8
VDD_3V3_SENSORS [power]: C605.P$1 C617.P$1 Q601.E U603.8(VOUT1) ; also sheet 5,12
VDD_3V3_SENSORS_EN: R603.P$2 R620.P$2 R635.P$2 U603.5(EN1) ; also sheet 1
VDD_5V_HIPOWER [power]: C614.P$1 U601.8(OUT) ; also sheet 2
VDD_5V_IN [power]: L603.P$1 R609.P$2 U601.1(IN) U602.1(IN) ; also sheet 7,10,11,12
VDD_5V_PERIPH [power]: C618.P$1 U602.8(OUT) ; also sheet 2,4
VDD_5V_SENS: R609.P$1 R610.P$1 ; also sheet 1

### Notes on the sheet
- Bypass caps as close to device pins as possible.
- Note: Maximise copper area connected 
  to center ground pad.
- Note: Do not populate R603 and R635.  
  Only one may be populated at a time.  (R603, R635 is DNP)
- POR reset 
  delay 1s / uF
- Current Limits:
  I(limit) = 25000 / R(ilim)
  25K = 1A, 16K5 = 1.5A
- Drain resistor for 
  Sensor Power Rail
- FMU Power and Reset

## Sheet 7 of 12
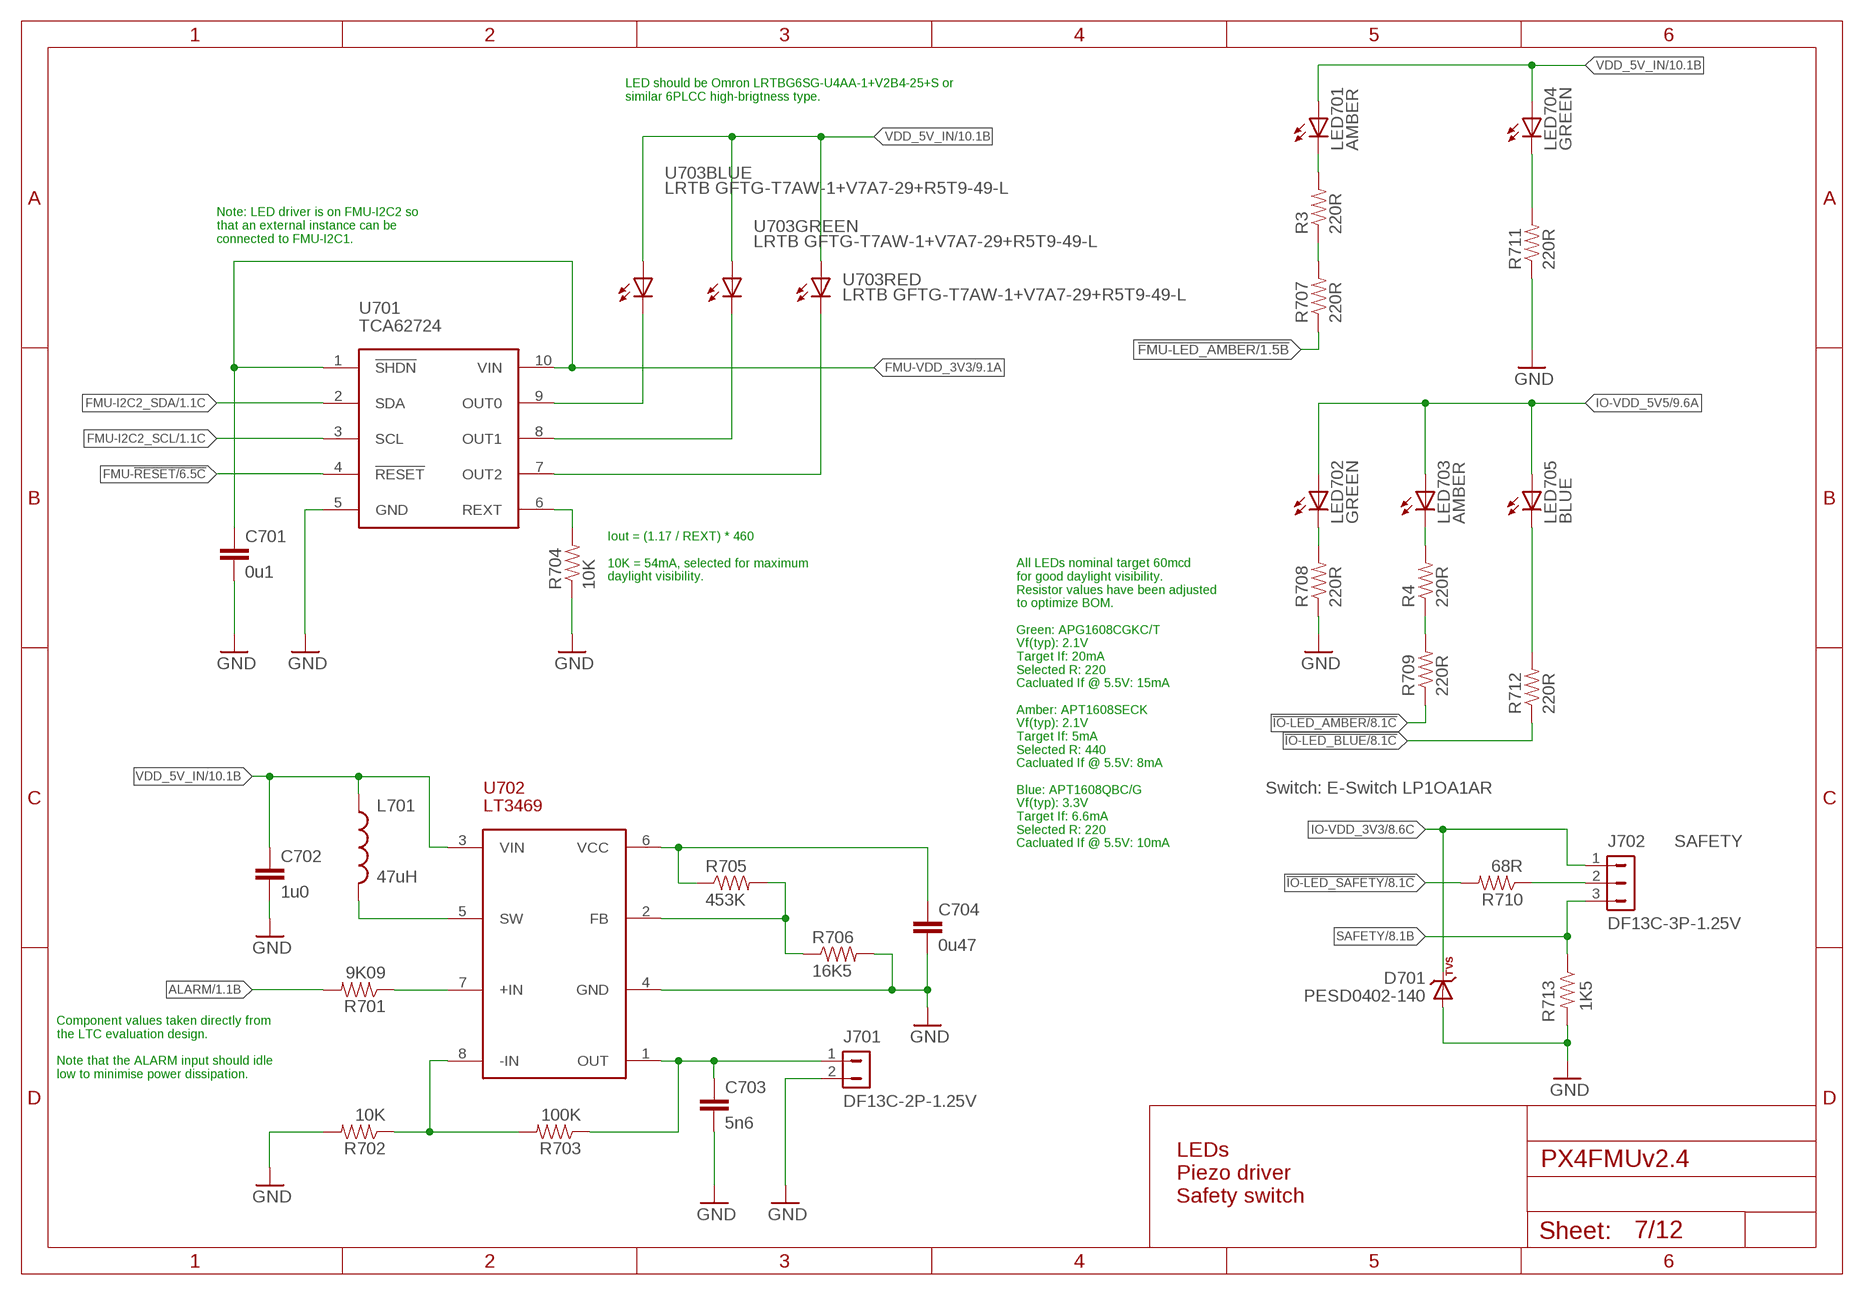
[diagram p6: schematic, sheet 7]

### Parts
C701  0u1  CAP0402  [0402-CAP]
C702  1u0  CAP0603  [0603-CAP]
C703  5n6  CAP0402  [0402-CAP]
C704  0u47  CAP0402  [0402-CAP]
D701  PESD0402-140  DIODE-TVS  [0402-TVS]
J701  DF13C-2P-1.25V  DF13-2P-1.25V  [DF13C-2P-1.25V]
J702  DF13C-3P-1.25V  DF13-3P-1.25V  [DF13C-3P-1.25V]
L701  47uH  INDUCTOR0805  [0805-IND]
LED701  AMBER  LED0603  [0603-LED]
LED702  GREEN  LED0603  [0603-LED]
LED703  AMBER  LED0603  [0603-LED]
LED704  GREEN  LED0603  [0603-LED]
LED705  BLUE  LED0603  [0603-LED]
R3  220R  RESISTOR0402-RES  [0402-RES]
R4  220R  RESISTOR0402-RES  [0402-RES]
R701  9K09  RESISTOR0402-RES  [0402-RES]
R702  10K  RESISTOR0402-RES  [0402-RES]
R703  100K  RESISTOR0402-RES  [0402-RES]
R704  10K  RESISTOR0402-RES  [0402-RES]
R705  453K  RESISTOR0402-RES  [0402-RES]
R706  16K5  RESISTOR0402-RES  [0402-RES]
R707  220R  RESISTOR0402-RES  [0402-RES]
R708  220R  RESISTOR0402-RES  [0402-RES]
R709  220R  RESISTOR0402-RES  [0402-RES]
R710  68R  RESISTOR0402-RES  [0402-RES]
R711  220R  RESISTOR0402-RES  [0402-RES]
R712  220R  RESISTOR0402-RES  [0402-RES]
R713  1K5  RESISTOR0402-RES  [0402-RES]
U701  TCA62724FMG  [SON10]
U702  LT3469  [SOT23-8]
U703  LRTB GFTG-T7AW-1+V7A7-29+R5T9-49-L  RGB-LED6-PLCC  [6-PLCC]

### Nets
!FMU-LED_AMBER: R707.P$1 ; also sheet 1
!IO-LED_AMBER: R709.P$1 ; also sheet 8
!IO-LED_BLUE: R712.P$1 ; also sheet 8
!IO-LED_SAFETY: R710.P$2 ; also sheet 8
ALARM: R701.P$2 ; also sheet 1
FMU-!RESET: U701.4(!RESET) ; also sheet 6
FMU-I2C2_SCL: U701.3(SCL) ; also sheet 1,3
FMU-I2C2_SDA: U701.2(SDA) ; also sheet 1,3
FMU-VDD_3V3 [power]: C701.P$1 U701.1(!SHDN) U701.10(VIN) ; also sheet 1,2,3,4,6,9,12
GND [power]: C701.P$2 C702.P$2 C703.P$2 C704.P$2 D701.A J701.2 R702.P$2 R704.P$1 R706.P$2 R708.P$1 R711.P$1 R713.P$2 U701.5(GND) U702.4(GND) ; also sheet 1,2,3,4,5,6,8,9,10,11,12
IO-VDD_3V3 [power]: D701.C J702.1 ; also sheet 8,9,10
IO-VDD_5V5 [power]: LED702.A LED703.A LED705.A ; also sheet 9,10
N$7: LED704.C R711.P$2
N$9: LED705.C R712.P$2
N$13: R3.P$1 R707.P$2
N$24: R705.P$2 R706.P$1 U702.2(FB)
N$25: R702.P$1 R703.P$2 U702.8(-IN)
N$26: LED701.C R3.P$2
N$27: C703.P$1 J701.1 R703.P$1 U702.1(OUT)
N$28: R701.P$1 U702.7(+IN)
N$29: LED702.C R708.P$2
N$32: L701.P$2 U702.5(SW)
N$36: C704.P$1 R705.P$1 U702.6(VCC)
N$39: R4.P$1 R709.P$2
N$40: LED703.C R4.P$2
N$57: J702.2 R710.P$1
N$95: R704.P$2 U701.6(REXT)
RGB_LED_3: U701.9(OUT0) U703.C1(BLUE:C)
RGB_LED_4: U701.8(OUT1) U703.C2(GREEN:C)
RGB_LED_14: U701.7(OUT2) U703.C3(RED:C)
SAFETY: J702.3 R713.P$1 ; also sheet 8
VDD_5V_IN [power]: C702.P$1 L701.P$1 LED701.A LED704.A U702.3(VIN) U703.A1(BLUE:A) U703.A2(GREEN:A) U703.A3(RED:A) ; also sheet 6,10,11,12

### Notes on the sheet
- LED should be Omron LRTBG6SG-U4AA-1+V2B4-25+S or 
  similar 6PLCC high-brigtness type.
- Note: LED driver is on FMU-I2C2 so
  that an external instance can be
  connected to FMU-I2C1.
- Iout = (1.17 / REXT) * 460
  
  10K = 54mA, selected for maximum
  daylight visibility.
- Switch: E-Switch LP1OA1AR
- All LEDs nominal target 60mcd
  for good daylight visibility.
  Resistor values have been adjusted
  to optimize BOM.
  
  Green: APG1608CGKC/T
  Vf(typ): 2.1V
  Target If: 20mA
  Selected R: 220
  Cacluated If @ 5.5V: 15mA
  
  Amber: APT1608SECK
  Vf(typ): 2.1V
  Target If: 5mA
  Selected R: 440
  Cacluated If @ 5.5V: 8mA
  
  Blue: APT1608QBC/G
  Vf(typ): 3.3V
  Target If: 6.6mA
  Selected R: 220
  Cacluated If @ 5.5V: 10mA
- SAFETY
- Component values taken directly from
  the LTC evaluation design.
  
  Note that the ALARM input should idle
  low to minimise power dissipation.
- LEDs
  Piezo driver
  Safety switch

## Sheet 8 of 12
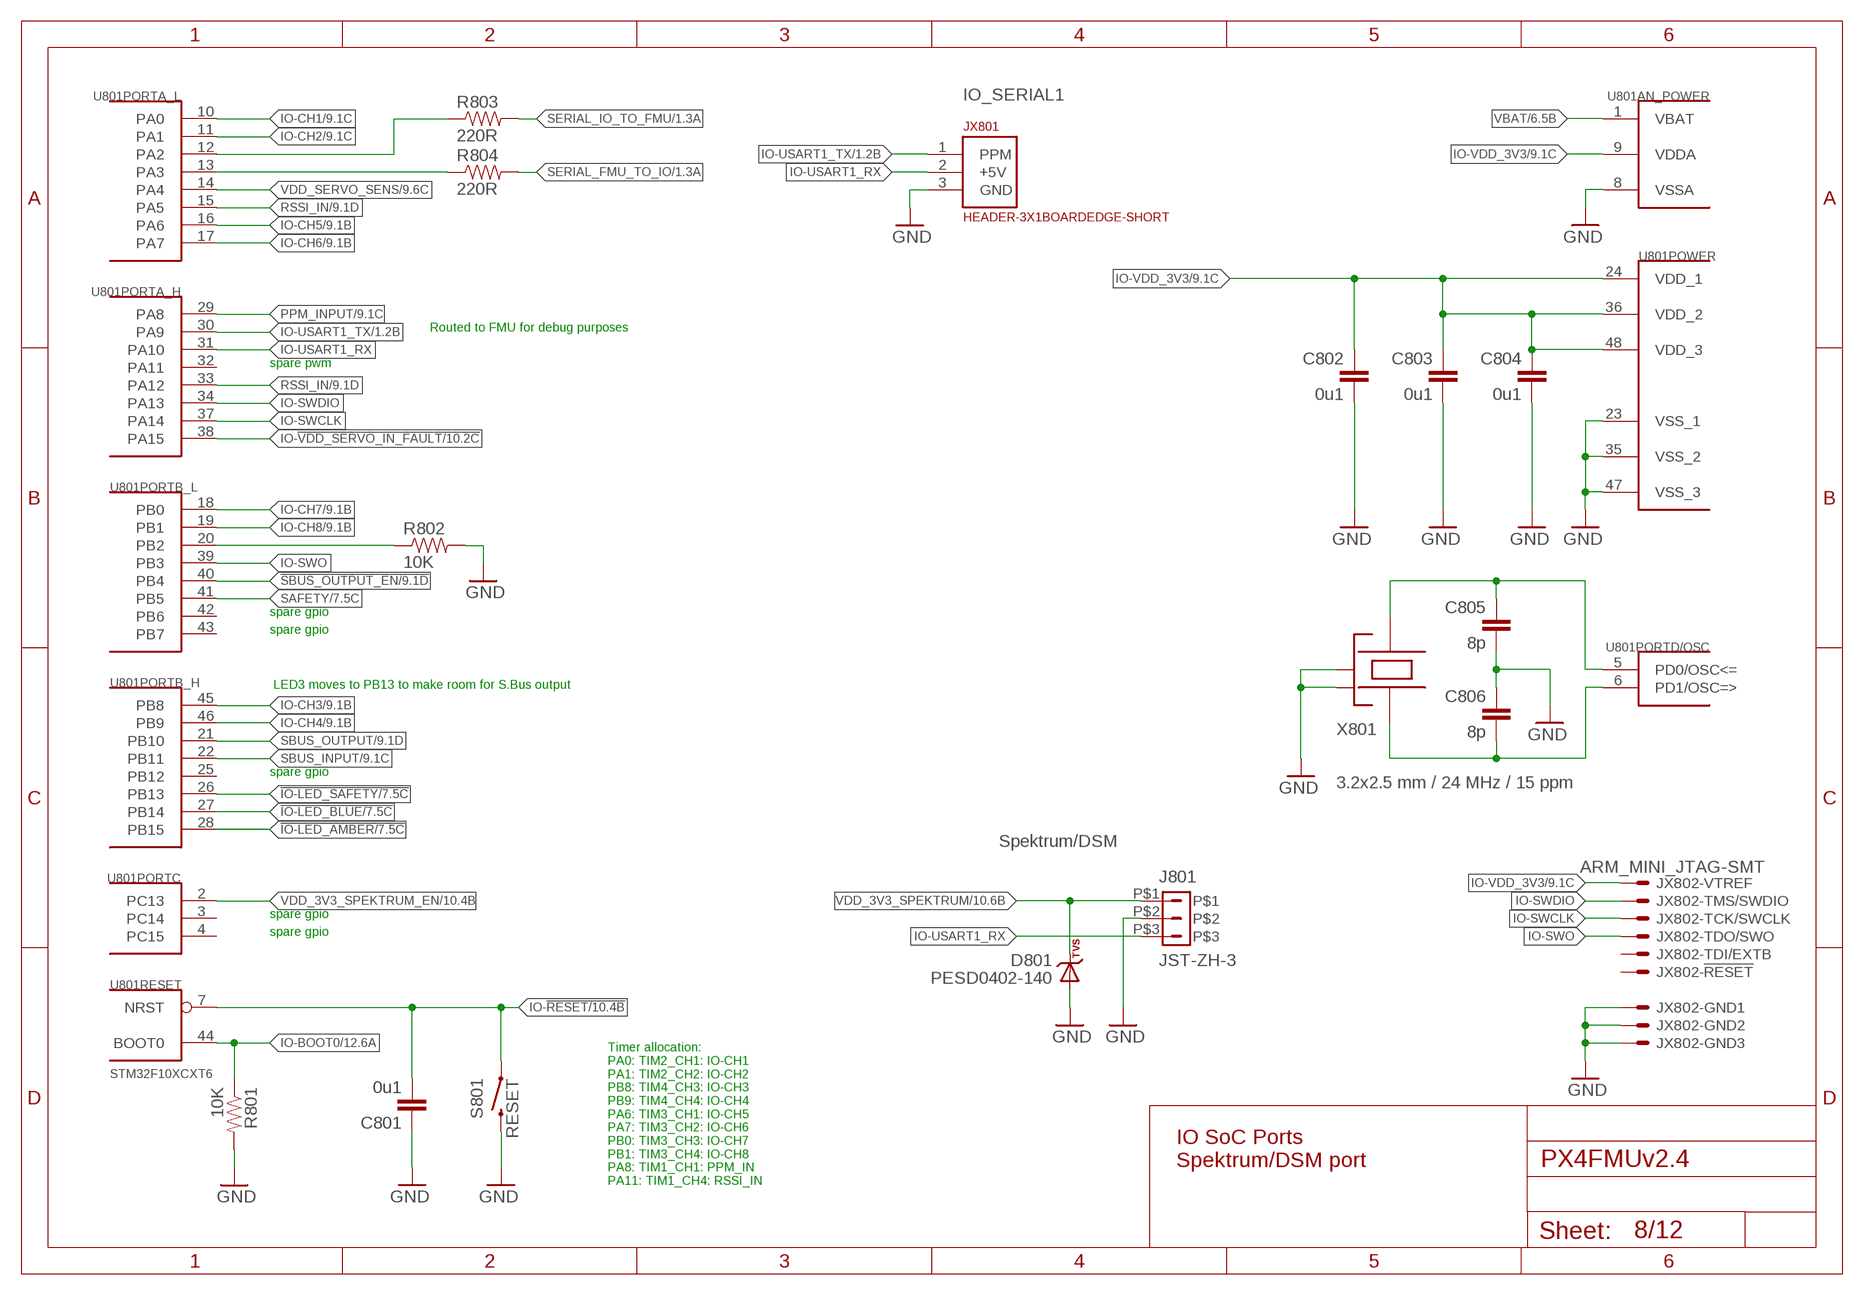
[diagram p7: schematic, sheet 8]

### Parts
C801  0u1  CAP0402  [0402-CAP]
C802  0u1  CAP0402  [0402-CAP]
C803  0u1  CAP0402  [0402-CAP]
C804  0u1  CAP0402  [0402-CAP]
C805  8p  CAP0402  [0402-CAP]
C806  8p  CAP0402  [0402-CAP]
D801  PESD0402-140  DIODE-TVS  [0402-TVS]
J801  JST-ZH-3  [JST-ZH-SMT-VERTICAL]
JX801  HEADER-3X1BOARDEDGE-SHORT  [HEADER_3X01_SMD_H_BOARD_EDGE_SHORT]
JX802  ARM_MINI_JTAG-SMT  [FTSH-105-01-XXX-DV-K]
R801  10K  RESISTOR0402-RES  [0402-RES]
R802  10K  RESISTOR0402-RES  [0402-RES]
R803  220R  RESISTOR0402-RES  [0402-RES]
R804  220R  RESISTOR0402-RES  [0402-RES]
S801  RESET  SWITCH-MOMENTARY-2  [EVQP7J01K]
U801  STM32F10XCXT6  [TQFP48]
X801  3.2x2.5 mm / 24 MHz / 15 ppm  OSCILLATOR-3.2X2.5  [OSCILLATOR-3.2X2.5]

### Nets
!IO-LED_AMBER: U801.28(PORTB_H:PB15) ; also sheet 7
!IO-LED_BLUE: U801.27(PORTB_H:PB14) ; also sheet 7
!IO-LED_SAFETY: U801.26(PORTB_H:PB13) ; also sheet 7
!SBUS_OUTPUT_EN: U801.40(PORTB_L:PB4) ; also sheet 9
GND [power]: C801.P$1 C802.P$2 C803.P$2 C804.P$2 C805.P$2 C806.P$1 D801.A J801.P$2 JX801.3(GND) JX802.3 JX802.5 JX802.9 R801.P$2 R802.P$2 S801.B3 U801.8(AN_POWER:VSSA) U801.23(POWER:VSS_1) U801.35(POWER:VSS_2) U801.47(POWER:VSS_3) X801.2(NC_2) X801.4(NC_4) ; also sheet 1,2,3,4,5,6,7,9,10,11,12
IO-!RESET: C801.P$2 S801.A1 U801.7(RESET:NRST) ; also sheet 10
IO-!VDD_SERVO_IN_FAULT: U801.38(PORTA_H:PA15) ; also sheet 10
IO-BOOT0: R801.P$1 U801.44(RESET:BOOT0) ; also sheet 12
IO-BOOT1: R802.P$1 U801.20(PORTB_L:PB2)
IO-CH1: U801.10(PORTA_L:PA0) ; also sheet 9
IO-CH2: U801.11(PORTA_L:PA1) ; also sheet 9
IO-CH3: U801.45(PORTB_H:PB8) ; also sheet 9
IO-CH4: U801.46(PORTB_H:PB9) ; also sheet 9
IO-CH5: U801.16(PORTA_L:PA6) ; also sheet 9
IO-CH6: U801.17(PORTA_L:PA7) ; also sheet 9
IO-CH7: U801.18(PORTB_L:PB0) ; also sheet 9
IO-CH8: U801.19(PORTB_L:PB1) ; also sheet 9
IO-SWCLK: JX802.4 U801.37(PORTA_H:PA14)
IO-SWDIO: JX802.2 U801.34(PORTA_H:PA13)
IO-SWO: JX802.6 U801.39(PORTB_L:PB3)
IO-USART1_RX: J801.P$3 JX801.2(+5V) U801.31(PORTA_H:PA10)
IO-USART1_TX: JX801.1(PPM) U801.30(PORTA_H:PA9) ; also sheet 1
IO-VDD_3V3 [power]: C802.P$1 C803.P$1 C804.P$1 JX802.1 U801.9(AN_POWER:VDDA) U801.24(POWER:VDD_1) U801.36(POWER:VDD_2) U801.48(POWER:VDD_3) ; also sheet 7,9,10
N$15: R803.P$1 U801.12(PORTA_L:PA2)
N$16: R804.P$1 U801.13(PORTA_L:PA3)
N$18: C806.P$2 U801.6(PORTD/OSC:PD1/OSC=>) X801.1
N$22: C805.P$1 U801.5(PORTD/OSC:PD0/OSC<=) X801.3
PPM_INPUT: U801.29(PORTA_H:PA8) ; also sheet 9
RSSI_IN: U801.15(PORTA_L:PA5) U801.33(PORTA_H:PA12) ; also sheet 9
SAFETY: U801.41(PORTB_L:PB5) ; also sheet 7
SBUS_INPUT: U801.22(PORTB_H:PB11) ; also sheet 9
SBUS_OUTPUT: U801.21(PORTB_H:PB10) ; also sheet 9
SERIAL_FMU_TO_IO: R804.P$2 ; also sheet 1
SERIAL_IO_TO_FMU: R803.P$2 ; also sheet 1
VBAT: U801.1(AN_POWER:VBAT) ; also sheet 6
VDD_3V3_SPEKTRUM [power]: D801.C J801.P$1 ; also sheet 10
VDD_3V3_SPEKTRUM_EN: U801.2(PORTC:PC13) ; also sheet 10
VDD_SERVO_SENS: U801.14(PORTA_L:PA4) ; also sheet 9
Unconnected: JX802.8 JX802.10 U801.3(PORTC:PC14) U801.4(PORTC:PC15) U801.25(PORTB_H:PB12) U801.32(PORTA_H:PA11) U801.42(PORTB_L:PB6) U801.43(PORTB_L:PB7)

### Notes on the sheet
- IO_SERIAL1
- Routed to FMU for debug purposes
- spare pwm
- spare gpio
- spare gpio
- LED3 moves to PB13 to make room for S.Bus output
- spare gpio
- Spektrum/DSM
- spare gpio
- spare gpio
- IO SoC Ports
  Spektrum/DSM port
- Timer allocation:
  PA0: TIM2_CH1: IO-CH1
  PA1: TIM2_CH2: IO-CH2
  PB8: TIM4_CH3: IO-CH3
  PB9: TIM4_CH4: IO-CH4
  PA6: TIM3_CH1: IO-CH5
  PA7: TIM3_CH2: IO-CH6
  PB0: TIM3_CH3: IO-CH7
  PB1: TIM3_CH4: IO-CH8
  PA8: TIM1_CH1: PPM_IN
  PA11: TIM1_CH4: RSSI_IN

## Sheet 9 of 12
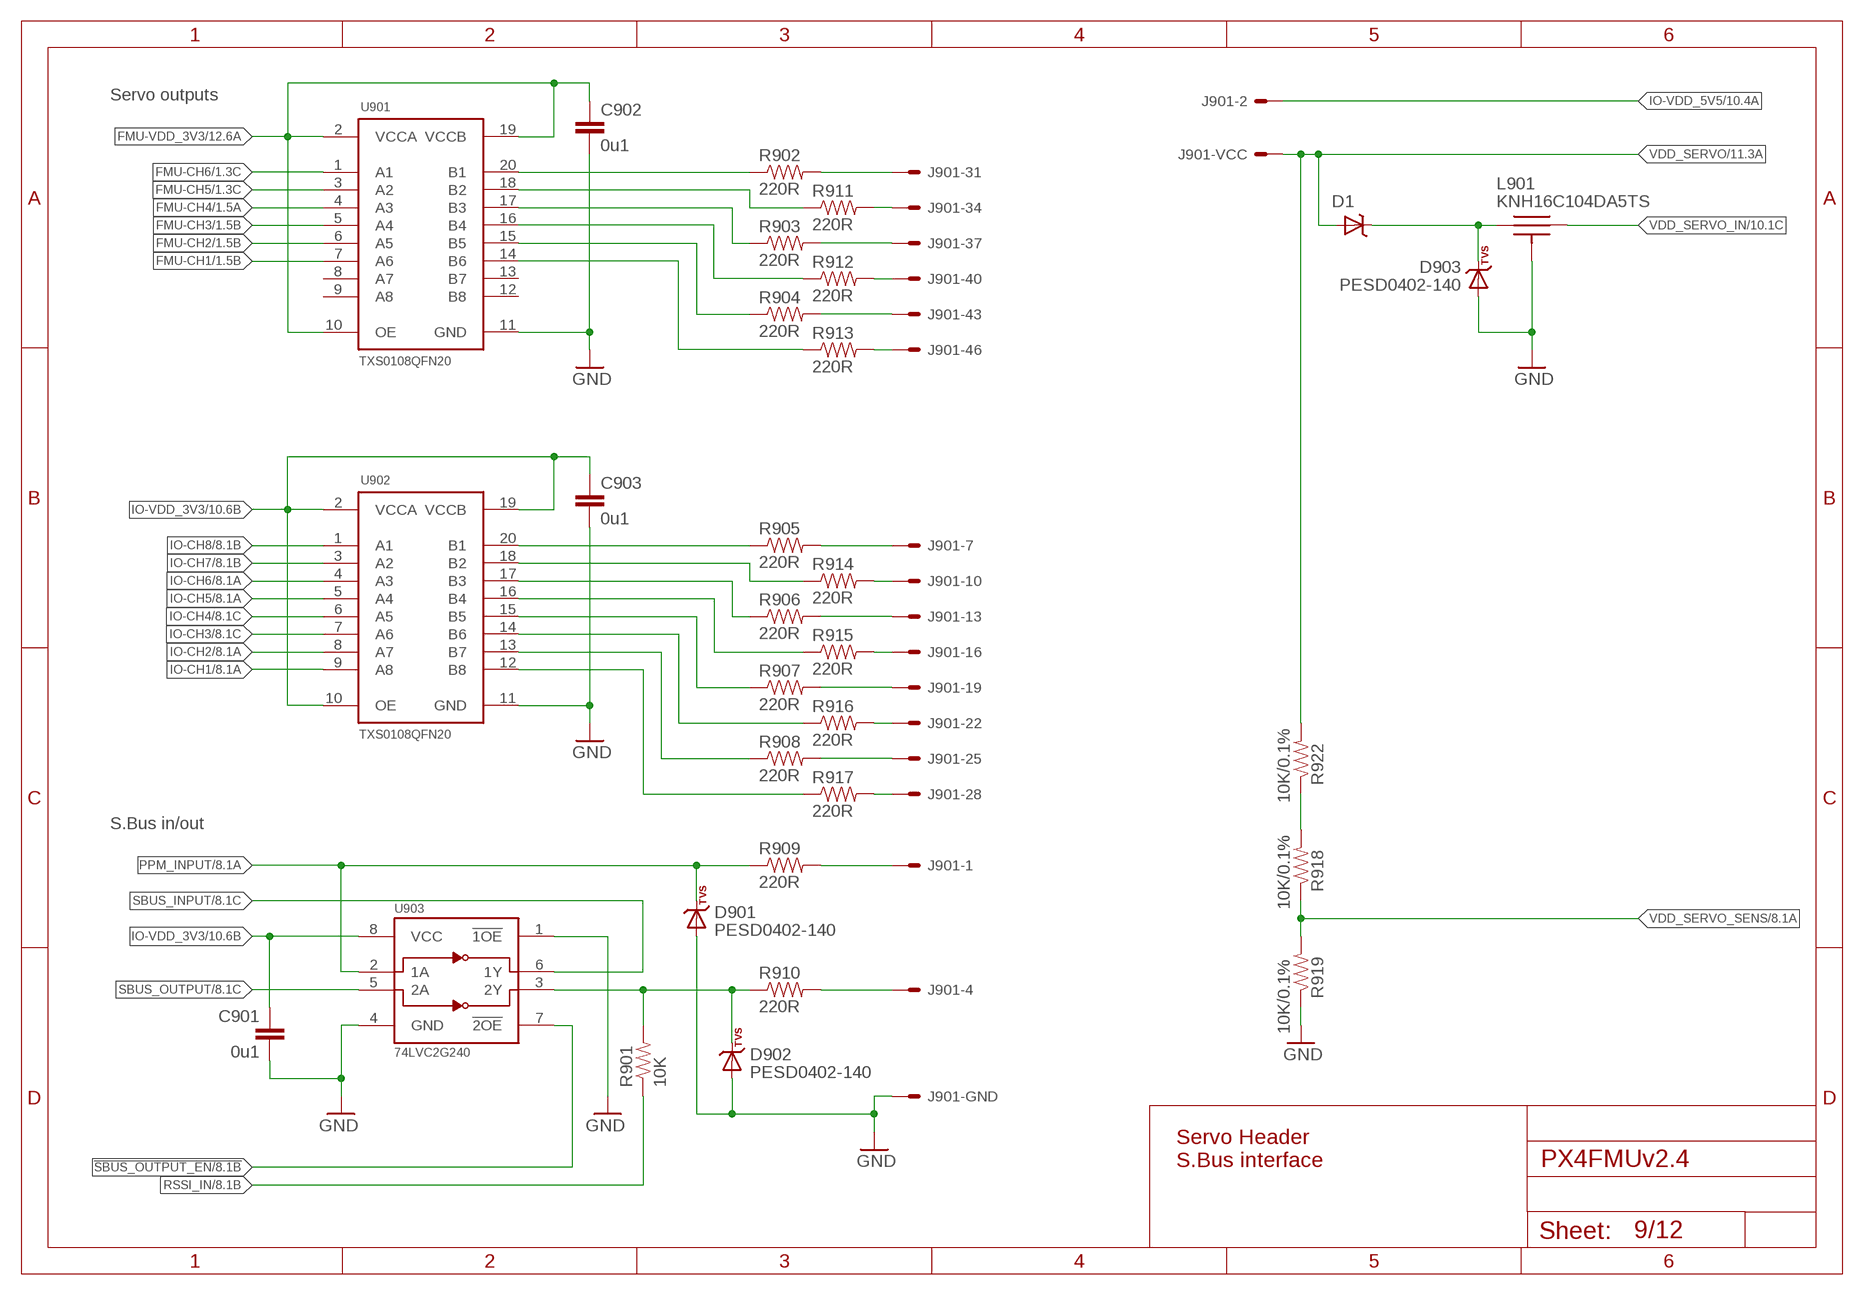
[diagram p8: schematic, sheet 9]

### Parts
C901  0u1  CAP0402  [0402-CAP]
C902  0u1  CAP0402  [0402-CAP]
C903  0u1  CAP0402  [0402-CAP]
D1  MSS1P4-M3  DIODE-SCHOTTKY_MSMP  [MICROSMP]
D901  PESD0402-140  DIODE-TVS  [0402-TVS]
D902  PESD0402-140  DIODE-TVS  [0402-TVS]
D903  PESD0402-140  DIODE-TVS  [0402-TVS]
J901  HEADER-3X163X16RA  [3X16RA]
L901  KNH16C104DA5TS  [KYOCERA-KNH16-DA]
R901  10K  RESISTOR0402-RES  [0402-RES]
R902  220R  RESISTOR0402-RES  [0402-RES]
R903  220R  RESISTOR0402-RES  [0402-RES]
R904  220R  RESISTOR0402-RES  [0402-RES]
R905  220R  RESISTOR0402-RES  [0402-RES]
R906  220R  RESISTOR0402-RES  [0402-RES]
R907  220R  RESISTOR0402-RES  [0402-RES]
R908  220R  RESISTOR0402-RES  [0402-RES]
R909  220R  RESISTOR0402-RES  [0402-RES]
R910  220R  RESISTOR0402-RES  [0402-RES]
R911  220R  RESISTOR0402-RES  [0402-RES]
R912  220R  RESISTOR0402-RES  [0402-RES]
R913  220R  RESISTOR0402-RES  [0402-RES]
R914  220R  RESISTOR0402-RES  [0402-RES]
R915  220R  RESISTOR0402-RES  [0402-RES]
R916  220R  RESISTOR0402-RES  [0402-RES]
R917  220R  RESISTOR0402-RES  [0402-RES]
R918  10K/0.1%  RESISTOR0402-RES  [0402-RES]
R919  10K/0.1%  RESISTOR0402-RES  [0402-RES]
R922  10K/0.1%  RESISTOR0402-RES  [0402-RES]
U901  TXS0108QFN20  [QFN20-RGY]
U902  TXS0108QFN20  [QFN20-RGY]
U903  74LVC2G240  74LVC2G240-TSSOP-8  [TSSOP8_SOT505-2]

### Nets
!SBUS_OUTPUT_EN: U903.7(!2OE) ; also sheet 8
FMU-CH1: U901.7(A6) ; also sheet 1
FMU-CH1-PROT: J901.46 R913.P$2
FMU-CH2: U901.6(A5) ; also sheet 1
FMU-CH3: U901.5(A4) ; also sheet 1
FMU-CH4: U901.4(A3) ; also sheet 1
FMU-CH5: U901.3(A2) ; also sheet 1
FMU-CH6: U901.1(A1) ; also sheet 1
FMU-CH6-PROT: J901.31 R902.P$2
FMU-VDD_3V3 [power]: C902.P$1 U901.2(VCCA) U901.10(OE) U901.19(VCCB) ; also sheet 1,2,3,4,6,7,12
GND [power]: C901.P$2 C902.P$2 C903.P$2 D901.A D902.A D903.A J901.3 J901.6 J901.9 J901.12 J901.15 J901.18 J901.21 J901.24 J901.27 J901.30 J901.33 J901.36 J901.39 J901.42 J901.45 J901.48 L901.P$3 L901.P$4 L901.P$5 R919.P$1 U901.11(GND) U902.11(GND) U903.1(!1OE) U903.4(GND) ; also sheet 1,2,3,4,5,6,7,8,10,11,12
IO-CH1: U902.9(A8) ; also sheet 8
IO-CH1-PROT: J901.28 R917.P$2
IO-CH2: U902.8(A7) ; also sheet 8
IO-CH3: U902.7(A6) ; also sheet 8
IO-CH4: U902.6(A5) ; also sheet 8
IO-CH5: U902.5(A4) ; also sheet 8
IO-CH6: U902.4(A3) ; also sheet 8
IO-CH7: U902.3(A2) ; also sheet 8
IO-CH8: U902.1(A1) ; also sheet 8
IO-CH8-PROT: J901.7 R905.P$2
IO-VDD_3V3 [power]: C901.P$1 C903.P$1 U902.2(VCCA) U902.10(OE) U902.19(VCCB) U903.8(VCC) ; also sheet 7,8,10
IO-VDD_5V5 [power]: J901.2 ; also sheet 7,10
N$3: R918.P$2 R922.P$1
N$31: J901.10 R914.P$2
N$38: D902.C R901.P$2 R910.P$1 U903.3(2Y)
N$43: R905.P$1 U902.20(B1)
N$44: R914.P$1 U902.18(B2)
N$45: R906.P$1 U902.17(B3)
N$49: R915.P$1 U902.16(B4)
N$53: R907.P$1 U902.15(B5)
N$58: R916.P$1 U902.14(B6)
N$59: R908.P$1 U902.13(B7)
N$60: R917.P$1 U902.12(B8)
N$61: R902.P$1 U901.20(B1)
N$62: R911.P$1 U901.18(B2)
N$63: R903.P$1 U901.17(B3)
N$64: R912.P$1 U901.16(B4)
N$65: R904.P$1 U901.15(B5)
N$66: R913.P$1 U901.14(B6)
N$68: J901.34 R911.P$2
N$71: J901.13 R906.P$2
N$72: J901.16 R915.P$2
N$73: J901.19 R907.P$2
N$74: J901.22 R916.P$2
N$75: J901.25 R908.P$2
N$77: J901.37 R903.P$2
N$78: J901.40 R912.P$2
N$79: J901.43 R904.P$2
N$99: J901.4 R910.P$2
N$110 [power]: D1.CATHODE(C) D903.C L901.P$1
PPM-SBUS-PROT: J901.1 R909.P$2
PPM_INPUT: D901.C R909.P$1 U903.2(1A) ; also sheet 8
RSSI_IN: R901.P$1 ; also sheet 8
SBUS_INPUT: U903.6(1Y) ; also sheet 8
SBUS_OUTPUT: U903.5(2A) ; also sheet 8
VDD_SERVO [power]: D1.ANODE(A) J901.5 J901.8 J901.11 J901.14 J901.17 J901.20 J901.23 J901.26 J901.29 J901.32 J901.35 J901.38 J901.41 J901.44 J901.47 R922.P$2 ; also sheet 11,12
VDD_SERVO_IN [power]: L901.P$2 ; also sheet 10
VDD_SERVO_SENS: R918.P$1 R919.P$2 ; also sheet 8
Unconnected: U901.8(A7) U901.9(A8) U901.12(B8) U901.13(B7)

### Notes on the sheet
- Servo outputs
- S.Bus in/out
- Servo Header
  S.Bus interface

## Sheet 10 of 12
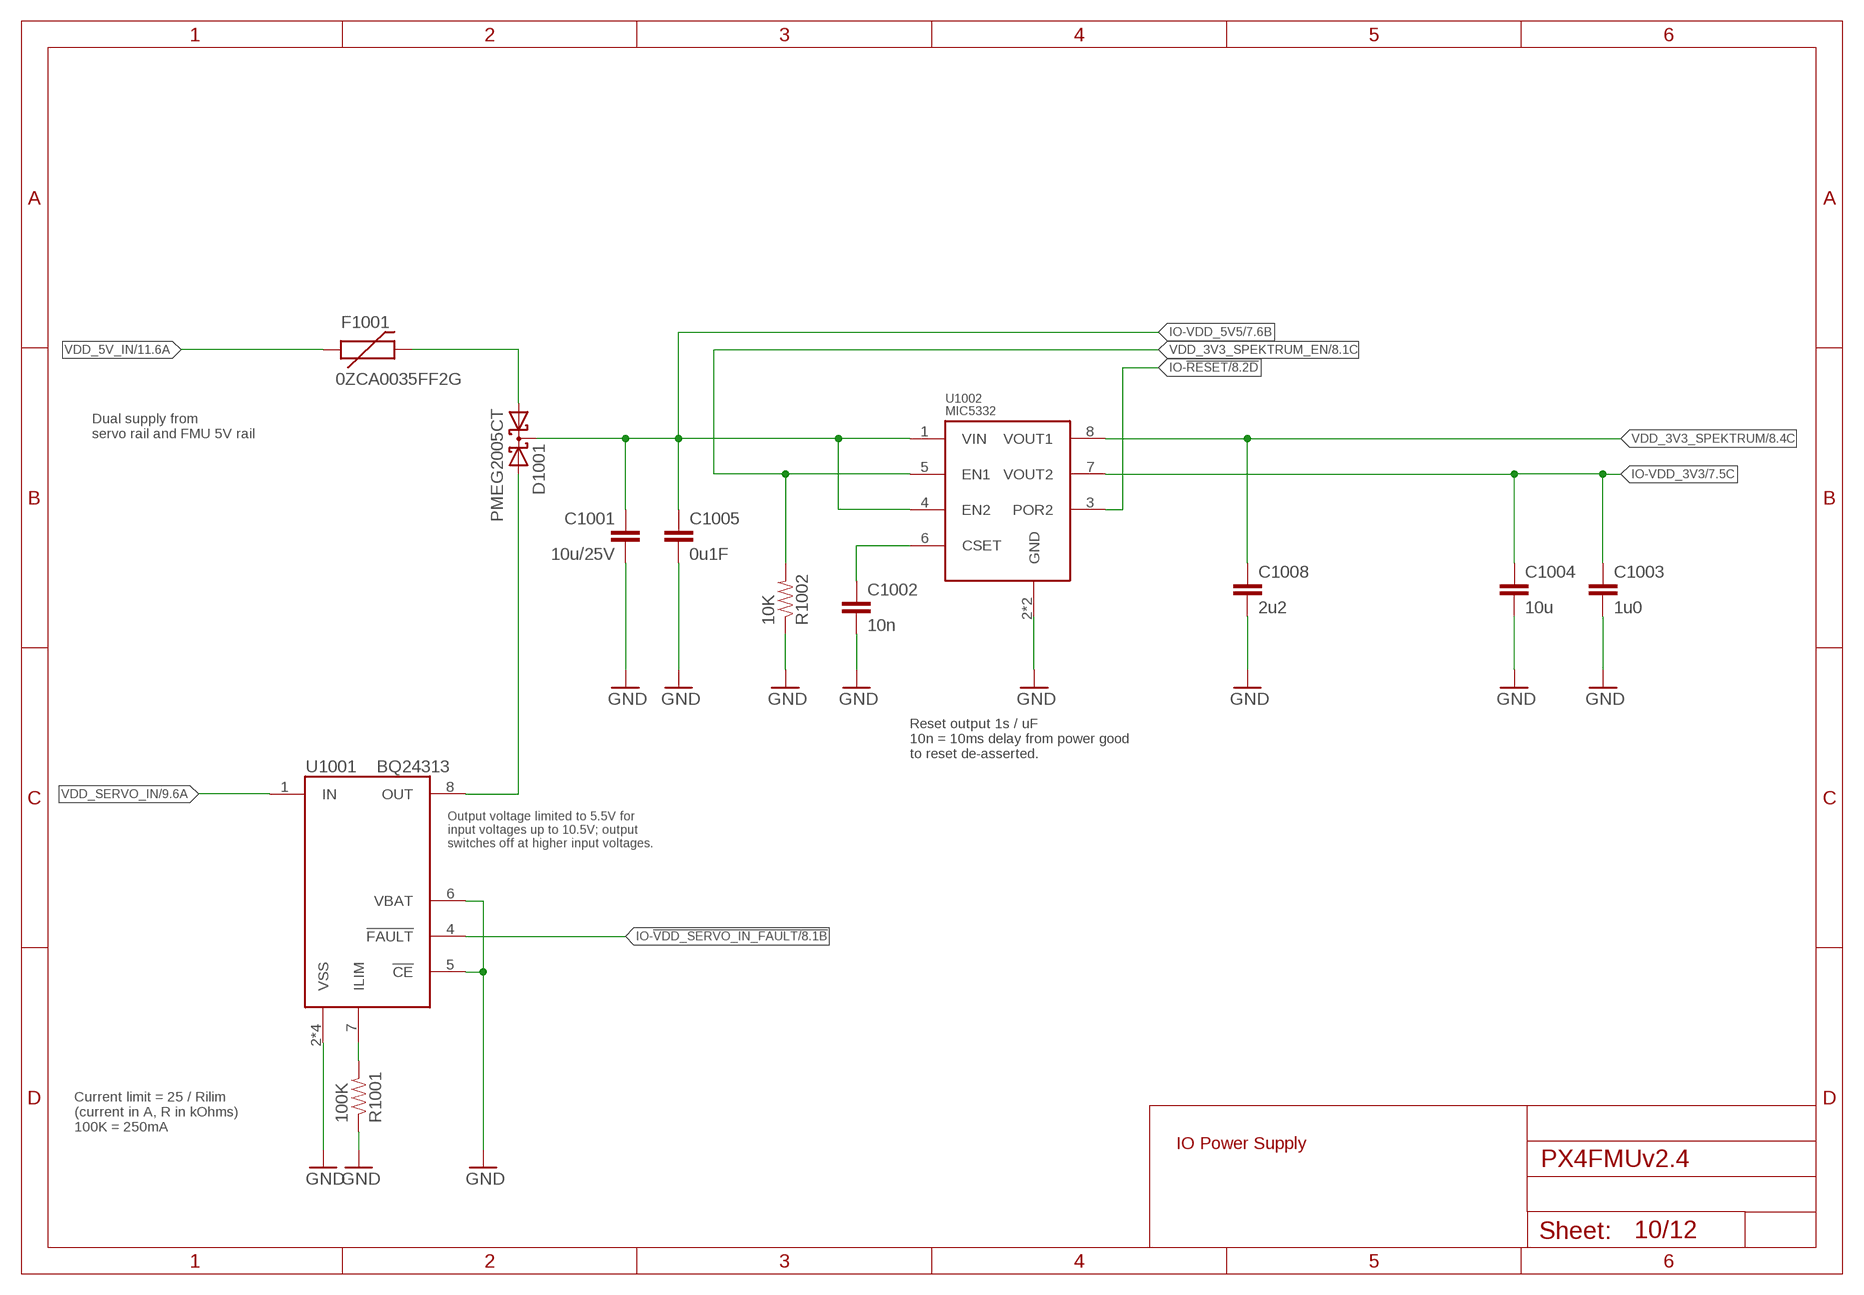
[diagram p9: schematic, sheet 10]

### Parts
C1001  10u/25V  CAP0805  [0805-CAP]
C1002  10n  CAP0402  [0402-CAP]
C1003  1u0  CAP0603  [0603-CAP]
C1004  10u  CAP0603  [0603-CAP]
C1005  0u1F  CAP0402  [0402-CAP]
C1008  2u2  CAP0402  [0402-CAP]
D1001  PMEG2005CT  [SOT23-3]
F1001  0ZCA0035FF2G  PTCSMD  [PTC-1206]
R1001  100K  RESISTOR0402-RES  [0402-RES]
R1002  10K  RESISTOR0402-RES  [0402-RES]
U1001  BQ24313  [QFN8-DSG]
U1002  MIC5332  [MLF-8-EPAD]

### Nets
GND [power]: C1001.P$2 C1002.P$2 C1003.P$2 C1004.P$2 C1005.P$2 C1008.P$2 R1001.P$1 R1002.P$1 U1001.2(VSS) U1001.5(!CE) U1001.6(VBAT) U1001.GND(VSS) U1001.P$2(VSS) U1001.P$3(VSS) U1002.2(GND) U1002.GND ; also sheet 1,2,3,4,5,6,7,8,9,11,12
IO-!RESET: U1002.3(POR2) ; also sheet 8
IO-!VDD_SERVO_IN_FAULT: U1001.4(!FAULT) ; also sheet 8
IO-VDD_3V3 [power]: C1003.P$1 C1004.P$1 U1002.7(VOUT2) ; also sheet 7,8,9
IO-VDD_5V5 [power]: C1001.P$1 C1005.P$1 D1001.3(CC) U1002.1(VIN) U1002.4(EN2) ; also sheet 7,9
N$4 [power]: D1001.2(A2) U1001.8(OUT)
N$20: R1001.P$2 U1001.7(ILIM)
N$46: D1001.1(A1) F1001.2
N$104: C1002.P$1 U1002.6(CSET)
VDD_3V3_SPEKTRUM [power]: C1008.P$1 U1002.8(VOUT1) ; also sheet 8
VDD_3V3_SPEKTRUM_EN: R1002.P$2 U1002.5(EN1) ; also sheet 8
VDD_5V_IN [power]: F1001.1 ; also sheet 6,7,11,12
VDD_SERVO_IN [power]: U1001.1(IN) ; also sheet 9

### Notes on the sheet
- Dual supply from
  servo rail and FMU 5V rail
- Reset output 1s / uF
  10n = 10ms delay from power good
  to reset de-asserted.
- Output voltage limited to 5.5V for
  input voltages up to 10.5V; output
  switches off at higher input voltages.
- Current limit = 25 / Rilim
  (current in A, R in kOhms)
  100K = 250mA
- IO Power Supply

## Sheet 11 of 12
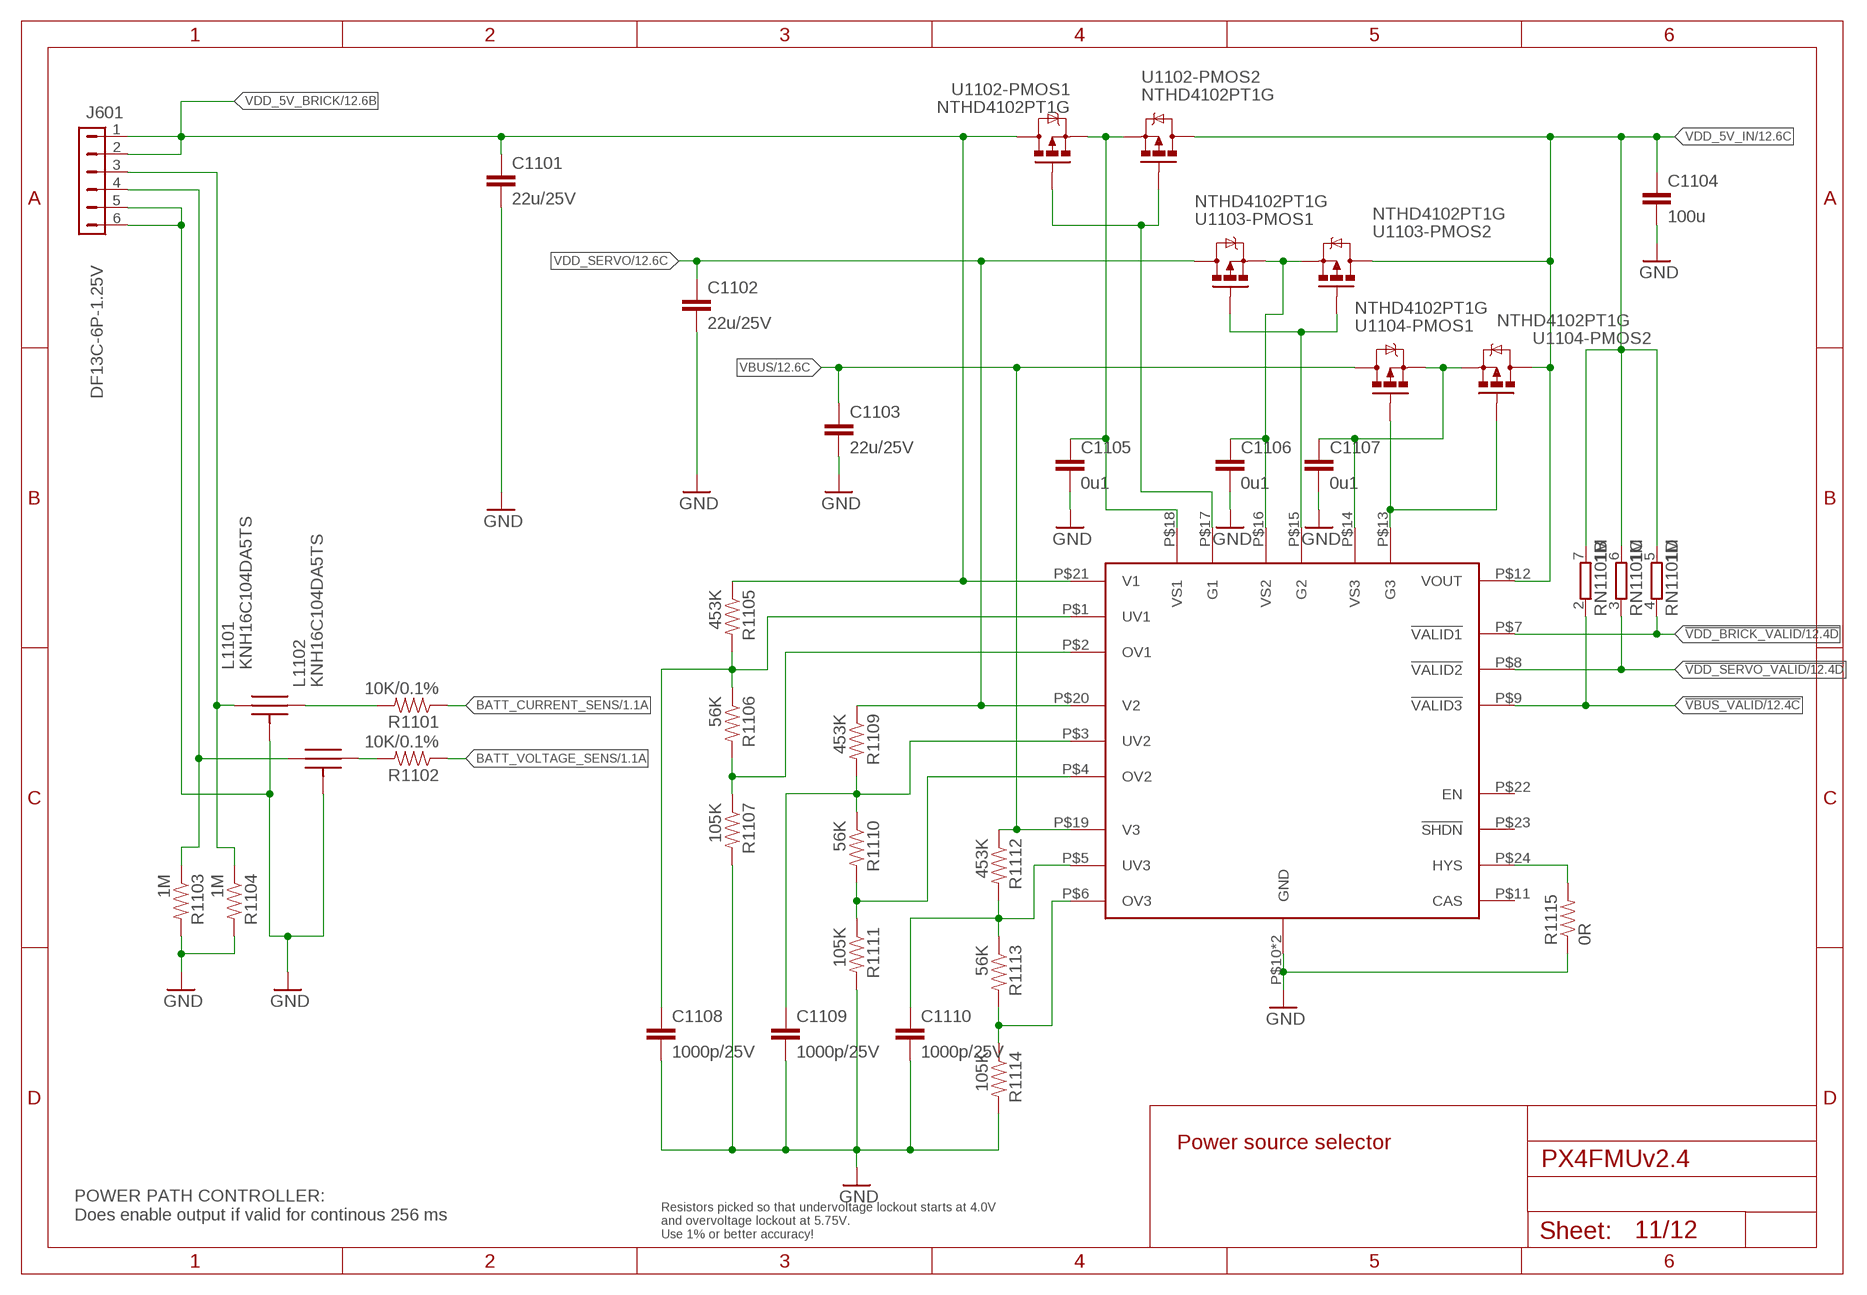
[diagram p10: schematic, sheet 11]

### Parts
C1101  22u/25V  CAP0805  [0805-CAP]
C1102  22u/25V  CAP0805  [0805-CAP]
C1103  22u/25V  CAP0805  [0805-CAP]
C1104  100u  CAP1206  [1206-CAP]
C1105  0u1  CAP0402  [0402-CAP]
C1106  0u1  CAP0402  [0402-CAP]
C1107  0u1  CAP0402  [0402-CAP]
C1108  1000p/25V  CAP0402  [0402-CAP]
C1109  1000p/25V  CAP0402  [0402-CAP]
C1110  1000p/25V  CAP0402  [0402-CAP]
J601  DF13C-6P-1.25V  DF13-6P-1.25V  [DF13C-6P-1.25V]
L1101  KNH16C104DA5TS  [KYOCERA-KNH16-DA]
L1102  KNH16C104DA5TS  [KYOCERA-KNH16-DA]
R1101  10K/0.1%  RESISTOR0402-RES  [0402-RES]
R1102  10K/0.1%  RESISTOR0402-RES  [0402-RES]
R1103  1M  RESISTOR0402-RES  [0402-RES]
R1104  1M  RESISTOR0402-RES  [0402-RES]
R1105  453K  RESISTOR0402-RES  [0402-RES]
R1106  56K  RESISTOR0402-RES  [0402-RES]
R1107  105K  RESISTOR0402-RES  [0402-RES]
R1109  453K  RESISTOR0402-RES  [0402-RES]
R1110  56K  RESISTOR0402-RES  [0402-RES]
R1111  105K  RESISTOR0402-RES  [0402-RES]
R1112  453K  RESISTOR0402-RES  [0402-RES]
R1113  56K  RESISTOR0402-RES  [0402-RES]
R1114  105K  RESISTOR0402-RES  [0402-RES]
R1115  0R  RESISTOR0402-RES  [0402-RES]
RN1101  1M  4R-NEXB28V  [EXB28V]
U1101  LTC4417  LTC4117  [MO-220]
U1102  NTHD4102PT1G  MOSFET-DUAL-PCHANNEL-CHIPFET  [1206-8]
U1103  NTHD4102PT1G  MOSFET-DUAL-PCHANNEL-CHIPFET  [1206-8]
U1104  NTHD4102PT1G  MOSFET-DUAL-PCHANNEL-CHIPFET  [1206-8]

### Nets
!VBUS_VALID: RN1101.2 U1101.P$9(!VALID3) ; also sheet 1,12
!VDD_BRICK_VALID: RN1101.4 U1101.P$7(!VALID1) ; also sheet 1,12
!VDD_SERVO_VALID: RN1101.3 U1101.P$8(!VALID2) ; also sheet 1,12
BATT_CURRENT_SENS: R1101.P$1 ; also sheet 1
BATT_CURRENT_SENS_PROT: J601.3 L1101.P$1 R1104.P$1
BATT_VOLTAGE_SENS: R1102.P$1 ; also sheet 1
BATT_VOLTAGE_SENS_PROT: J601.4 L1102.P$1 R1103.P$1
GND [power]: C1101.P$2 C1102.P$2 C1103.P$2 C1104.P$2 C1105.P$2 C1106.P$2 C1107.P$2 C1108.P$2 C1109.P$2 C1110.P$2 J601.5 J601.6 L1101.P$3 L1101.P$4 L1101.P$5 L1102.P$3 L1102.P$4 L1102.P$5 R1103.P$2 R1104.P$2 R1107.P$2 R1111.P$2 R1114.P$2 R1115.P$1 U1101.P$10(GND) U1101.P$25(GND) ; also sheet 1,2,3,4,5,6,7,8,9,10,12
N$47: C1108.P$1 R1105.P$2 R1106.P$1 U1101.P$1(UV1)
N$54: R1106.P$2 R1107.P$1 U1101.P$2(OV1)
N$55: C1109.P$1 R1109.P$2 R1110.P$1 U1101.P$3(UV2)
N$56: R1110.P$2 R1111.P$1 U1101.P$4(OV2)
N$67: R1113.P$2 R1114.P$1 U1101.P$6(OV3)
N$69: C1110.P$1 R1112.P$2 R1113.P$1 U1101.P$5(UV3)
N$97 [power]: C1105.P$1 U1101.P$18(VS1) U1102.P$1(-PMOS1:S) U1102.P$3(-PMOS2:S)
N$102: L1102.P$2 R1102.P$2
N$103: L1101.P$2 R1101.P$2
N$105: R1115.P$2 U1101.P$24(HYS)
N$106 [power]: C1106.P$1 U1101.P$16(VS2) U1103.P$1(-PMOS1:S) U1103.P$3(-PMOS2:S)
N$107 [power]: C1107.P$1 U1101.P$14(VS3) U1104.P$1(-PMOS1:S) U1104.P$3(-PMOS2:S)
N$109: U1101.P$13(G3) U1104.P$2(-PMOS1:G) U1104.P$4(-PMOS2:G)
N$113: U1101.P$15(G2) U1103.P$2(-PMOS1:G) U1103.P$4(-PMOS2:G)
N$115: U1101.P$17(G1) U1102.P$2(-PMOS1:G) U1102.P$4(-PMOS2:G)
VBUS [power]: C1103.P$1 R1112.P$1 U1101.P$19(V3) U1104.P$7(-PMOS1:D) U1104.P$8(-PMOS1:D) ; also sheet 1,3,12
VDD_5V_BRICK [power]: C1101.P$1 J601.1 J601.2 R1105.P$1 U1101.P$21(V1) U1102.P$7(-PMOS1:D) U1102.P$8(-PMOS1:D) ; also sheet 12
VDD_5V_IN [power]: C1104.P$1 RN1101.5 RN1101.6 RN1101.7 U1101.P$12(VOUT) U1102.P$5(-PMOS2:D) U1102.P$6(-PMOS2:D) U1103.P$5(-PMOS2:D) U1103.P$6(-PMOS2:D) U1104.P$5(-PMOS2:D) U1104.P$6(-PMOS2:D) ; also sheet 6,7,10,12
VDD_SERVO [power]: C1102.P$1 R1109.P$1 U1101.P$20(V2) U1103.P$7(-PMOS1:D) U1103.P$8(-PMOS1:D) ; also sheet 9,12
Unconnected: RN1101.1 RN1101.8 U1101.P$11(CAS) U1101.P$22(EN) U1101.P$23(!SHDN)

### Notes on the sheet
- Power source selector
- POWER PATH CONTROLLER:
  Does enable output if valid for continous 256 ms
- Resistors picked so that undervoltage lockout starts at 4.0V
  and overvoltage lockout at 5.75V.
  Use 1% or better accuracy!

## Sheet 12 of 12
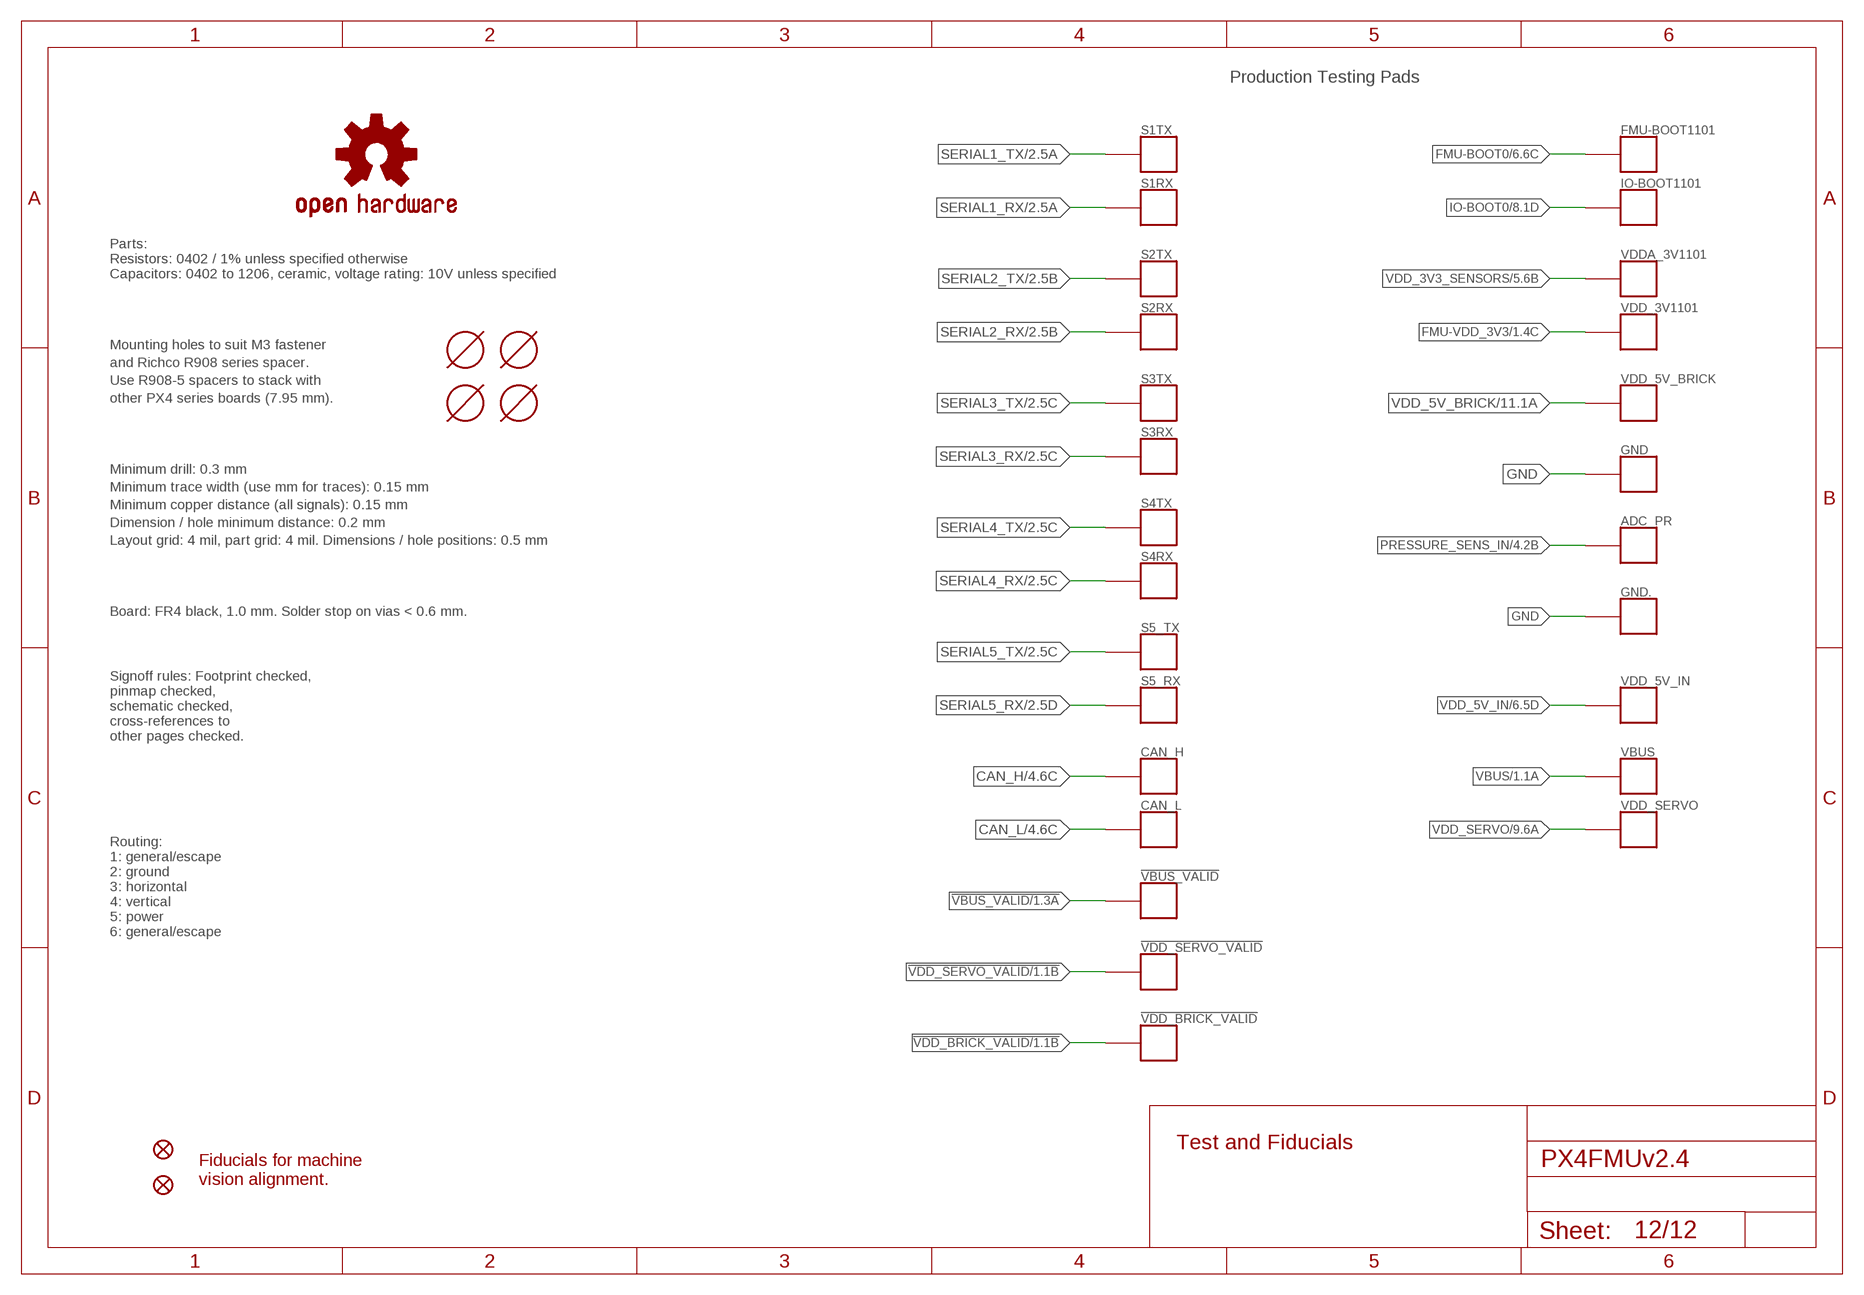
[diagram p11: schematic, sheet 12]

### Parts
!VBUS_VALID  PAD.04  [PAD.04X.04]
!VDD_BRICK_VALID  PAD.04  [PAD.04X.04]
!VDD_SERVO_VALID  PAD.04  [PAD.04X.04]
ADC_PR  PAD.04  [PAD.04X.04]
CAN_H  PAD.04  [PAD.04X.04]
CAN_L  PAD.04  [PAD.04X.04]
FMU-BOOT1101  PAD.04  [PAD.04X.04]
GND  PAD.04  [PAD.04X.04]
GND.  PAD.04  [PAD.04X.04]
IO-BOOT1101  PAD.04  [PAD.04X.04]
JP1  FIDUCIAL1.5X3  [FIDUCIAL-1.5X3]
JP2  FIDUCIAL1.5X3  [FIDUCIAL-1.5X3]
M3_MOUNT1101  MOUNT-HOLE3.1MM  [MOUNT-HOLE3.1]
M3_MOUNT1102  MOUNT-HOLE3.1MM  [MOUNT-HOLE3.1]
M3_MOUNT1103  MOUNT-HOLE3.1MM  [MOUNT-HOLE3.1]
M3_MOUNT1104  MOUNT-HOLE3.1MM  [MOUNT-HOLE3.1]
OSHW_LOGO  OSHW-LOGOS  [OSHW-LOGO-S]
S1RX  PAD.04  [PAD.04X.04]
S1TX  PAD.04  [PAD.04X.04]
S2RX  PAD.04  [PAD.04X.04]
S2TX  PAD.04  [PAD.04X.04]
S3RX  PAD.04  [PAD.04X.04]
S3TX  PAD.04  [PAD.04X.04]
S4RX  PAD.04  [PAD.04X.04]
S4TX  PAD.04  [PAD.04X.04]
S5_RX  PAD.04  [PAD.04X.04]
S5_TX  PAD.04  [PAD.04X.04]
VBUS  PAD.04  [PAD.04X.04]
VDD_3V1101  PAD.04  [PAD.04X.04]
VDD_5V_BRICK  PAD.04  [PAD.04X.04]
VDD_5V_IN  PAD.04  [PAD.04X.04]
VDD_SERVO  PAD.04  [PAD.04X.04]
VDDA_3V1101  PAD.04  [PAD.04X.04]

### Nets
!VBUS_VALID: !VBUS_VALID.P$1 ; also sheet 1,11
!VDD_BRICK_VALID: !VDD_BRICK_VALID.P$1 ; also sheet 1,11
!VDD_SERVO_VALID: !VDD_SERVO_VALID.P$1 ; also sheet 1,11
CAN_H: CAN_H.P$1 ; also sheet 4
CAN_L: CAN_L.P$1 ; also sheet 4
FMU-BOOT0: FMU-BOOT1101.P$1 ; also sheet 6
FMU-VDD_3V3 [power]: VDD_3V1101.P$1 ; also sheet 1,2,3,4,6,7,9
GND [power]: GND..P$1 GND.P$1 ; also sheet 1,2,3,4,5,6,7,8,9,10,11
IO-BOOT0: IO-BOOT1101.P$1 ; also sheet 8
PRESSURE_SENS_IN: ADC_PR.P$1 ; also sheet 4
SERIAL1_RX: S1RX.P$1 ; also sheet 2
SERIAL1_TX: S1TX.P$1 ; also sheet 2
SERIAL2_RX: S2RX.P$1 ; also sheet 2
SERIAL2_TX: S2TX.P$1 ; also sheet 2
SERIAL3_RX: S3RX.P$1 ; also sheet 2
SERIAL3_TX: S3TX.P$1 ; also sheet 2
SERIAL4_RX: S4RX.P$1 ; also sheet 2
SERIAL4_TX: S4TX.P$1 ; also sheet 2
SERIAL5_RX: S5_RX.P$1 ; also sheet 2
SERIAL5_TX: S5_TX.P$1 ; also sheet 2
VBUS [power]: VBUS.P$1 ; also sheet 1,3,11
VDD_3V3_SENSORS [power]: VDDA_3V1101.P$1 ; also sheet 5,6
VDD_5V_BRICK [power]: VDD_5V_BRICK.P$1 ; also sheet 11
VDD_5V_IN [power]: VDD_5V_IN.P$1 ; also sheet 6,7,10,11
VDD_SERVO [power]: VDD_SERVO.P$1 ; also sheet 9,11

### Notes on the sheet
- Production Testing Pads
- Parts:
  Resistors: 0402 / 1% unless specified otherwise
  Capacitors: 0402 to 1206, ceramic, voltage rating: 10V unless specified
- Mounting holes to suit M3 fastener
- and Richco R908 series spacer.
- Use R908-5 spacers to stack with
- other PX4 series boards (7.95 mm).
- Minimum drill: 0.3 mm
- Minimum trace width (use mm for traces): 0.15 mm
- Minimum copper distance (all signals): 0.15 mm
- Dimension / hole minimum distance: 0.2 mm
- Layout grid: 4 mil, part grid: 4 mil. Dimensions / hole positions: 0.5 mm
- Board: FR4 black, 1.0 mm. Solder stop on vias < 0.6 mm.
- Signoff rules: Footprint checked,
  pinmap checked,
  schematic checked, 
  cross-references to
  other pages checked.
- Routing:
  1: general/escape
  2: ground
  3: horizontal
  4: vertical
  5: power
  6: general/escape
- Test and Fiducials
- Fiducials for machine
  vision alignment.

## Library data of the parts
!VBUS_VALID !VDD_BRICK_VALID !VDD_SERVO_VALID ADC_PR CAN_H CAN_L FMU-BOOT1101 GND GND. IO-BOOT1101 S1RX S1TX S2RX S2TX S3RX S3TX S4RX S4TX S5_RX S5_TX VBUS VDD_3V1101 VDD_5V_BRICK VDD_5V_IN VDD_SERVO VDDA_3V1101 = pixhawk2:PAD: Test pad This footprint includes three classes: The actual test pads, a pogo-pin footprint to mount the pogo-pin as through-hole part and a hole footprint which allows the head of the pogo-pin to pass through (do NOT use the hole to mount the pogo-pin). In a typical test setup, the stack would consist of three PCBs: The actual PCB under testing with a test pad on the bottom, then a second PCB with the hole for the pogo-pin head where the PCB under testing is pressed on and a third PCB at 30 mm / 1.2" distance with the pogo-pin footprints. The pogo-pins are soldered to the last PCB. To create the stack, copy the board under testing and exchange the footprints - this way the correct positioning is ensured.; BOM: EXCLUDE; PARTNO: *
B601 = pixhawk2:MS621FE: SEIKO 6.8mm Rechargeable 3V lithium battery If discontinued or not available, similar devices are available from Panasonic and Sanyo, usually direct replacements.; DATASHEET: http://speed.sii.co.jp/data/file_PRODUCT_MASTER_50112_TITLE_IMAGESP.pdf; LINK: http://search.digikey.com/us/en/products/MS621FE-FL11E/728-1057-ND/1889208; MFGPN: MS621FE; PARTNO: MS621FE-FL11E
C101 C201 C202 C401 C402 C502 C503 C507 C508 C512-C514 C606-C610 C612 C615-C617 C701 C801-C804 C901-C903 C1005 C1105-C1107 = pixhawk2:CAP: Capacitor Standard 0603 ceramic capacitor, and 0.1" leaded capacitor.; PARTNO: CC0402ZRY5V7BB104
C102 C103 C805 C806 = pixhawk2:CAP: Capacitor Standard 0603 ceramic capacitor, and 0.1" leaded capacitor.; PARTNO: C1005C0G1H080C
C501 C506 C509 C511 = pixhawk2:CAP: Capacitor Standard 0603 ceramic capacitor, and 0.1" leaded capacitor.; PARTNO: CC0805ZKY5V6BB106
C504 C505 C602 C1002 = pixhawk2:CAP: Capacitor Standard 0603 ceramic capacitor, and 0.1" leaded capacitor.; PARTNO: CC0402KRX7R7BB103
C510 C704 = pixhawk2:CAP: Capacitor Standard 0603 ceramic capacitor, and 0.1" leaded capacitor.; PARTNO: C1005X5R1C474K050BC
C515 = pixhawk2:CAP: Capacitor Standard 0603 ceramic capacitor, and 0.1" leaded capacitor.; PARTNO: GRM155R71E103JA01J
C601 C1001 = pixhawk2:CAP: Capacitor Standard 0603 ceramic capacitor, and 0.1" leaded capacitor.; PARTNO: CL21A106KAYNNNE
C603 C702 C1003 C1004 C1008 = pixhawk2:CAP: Capacitor Standard 0603 ceramic capacitor, and 0.1" leaded capacitor.; PARTNO: CC0603ZRY5V7BB105
C604 C605 C1101-C1103 = pixhawk2:CAP: Capacitor Standard 0603 ceramic capacitor, and 0.1" leaded capacitor.; PARTNO: CL21A226MAQNNNE
C611 C613 = pixhawk2:CAP: Capacitor Standard 0603 ceramic capacitor, and 0.1" leaded capacitor.; PARTNO: C1608Y5V1C225Z
C614 C618 C1104 = pixhawk2:CAP: Capacitor Standard 0603 ceramic capacitor, and 0.1" leaded capacitor.; PARTNO: C3216X5R1A107M160AC
C703 = pixhawk2:CAP: Capacitor Standard 0603 ceramic capacitor, and 0.1" leaded capacitor.; PARTNO: CC0402KRX7R7BB562
C1108-C1110 = pixhawk2:CAP: Capacitor Standard 0603 ceramic capacitor, and 0.1" leaded capacitor.; PARTNO: GRM1555C1E102JA01D
D1 = pixhawk2:DIODE-SCHOTTKY: Schottky barrier diode in DO214AC, e.g. Fairchild SS14.; PARTNO: MSS1P4-M3/89A
D2 = pixhawk2:DIODE-SCHOTTKY: Schottky barrier diode in DO214AC, e.g. Fairchild SS14.; PARTNO: RB751V40T1G
D201-D203 D401-D404 D701 D801 D901-D903 = pixhawk2:DIODE-TVS; PARTNO: PESD0402-140
D1001 = pixhawk2:PMEG2005CT: 500 mA low VF dual MEGA Schottky barrier rectifier http://www.nxp.com/documents/data_sheet/PMEG2005CT.pdf; PARTNO: PMEG2005CT
F1001 = pixhawk2:PTC: Resettable Fuse PTC Resettable Fuse. Spark Fun Electronics SKU : COM-08357; PARTNO: 0ZCA0035FF2G
J201-J204 J601 = con-hirose-df13:DF13-6P-1.25: DF13-6P 1.25mm Pitch Miniature Crimping Connector.; PARTNO: DF13C-6P-1.25V(20)
J301 = pixhawk2:MOLEX-47346-0001: MICRO USB B, BOTTOM MOUNT; PARTNO: 47346-0001
J302 J401 J405 = con-hirose-df13:DF13-4P-1.25: DF13-4P 1.25mm Pitch Miniature Crimping Connector.; PARTNO: DF13C-4P-1.25V(20)
J402 J702 = con-hirose-df13:DF13-3P-1.25: DF13-3P 1.25mm Pitch Miniature Crimping Connector.; PARTNO: DF13C-3P-1.25V(20)
J403 = con-hirose-df13:DF13-7P-1.25: DF13-7P 1.25mm Pitch Miniature Crimping Connector.; PARTNO: DF13C-7P-1.25V(20)
J404 = con-hirose-df13:DF13-5P-1.25: DF13-5P 1.25mm Pitch Miniature Crimping Connector.; PARTNO: DF13C-5P-1.25V(20)
J701 = con-hirose-df13:DF13-2P-1.25: DF13-2P 1.25mm Pitch Miniature Crimping Connector.; PARTNO: DF13C-2P-1.25V(20)
J801 = for-transfers:JST-ZH-3; PARTNO: B3B-ZR-SM4-TF (LF)(SN)(P)
J901 = pixhawk2:HEADER-3X16: 3x16 servo header; BOM: EXCLUDE
JP1 JP2 = pixhawk2:FIDUCIAL: Fiducial Alignment Points Various fiducial points for machine vision alignment.; BOM: EXCLUDE; PARTNO: *
JX301 JX802 = pixhawk2:ARM_MINI_JTAG: CONNECTOR wire to board 1.25 mm (.049 inch) pitch header; BOM: EXCLUDE; PARTNO: M50-3900542
JX801 = pixhawk2:HEADER-3X1: Single row 0.1" servo header; BOM: EXCLUDE
L201-L203 L401-L404 L603 L901 L1101 L1102 = pixhawk2:KNH16C104DA5TS: Kyocera KNH16C104DA5TS EMI filter; PARTNO: KNH16C104DA5TS
L701 = pixhawk2:INDUCTOR: Inductors Basic Inductor/Choke - 0603 and 1210. Footprints are not proven and vary greatly between part numbers. SRR1210: Bourns SRR1210 parts, e.g. SRR1210-100M; PARTNO: MLZ2012M470W
LED701 LED703 = pixhawk2:LED: LEDs Standard schematic elements and footprints for 5mm, 3mm, 1206, and 0603 sized LEDs. 5mm - Spark Fun Electronics SKU : COM-00529 (and others); PARTNO: APTD1608SECK
LED702 LED704 = pixhawk2:LED: LEDs Standard schematic elements and footprints for 5mm, 3mm, 1206, and 0603 sized LEDs. 5mm - Spark Fun Electronics SKU : COM-00529 (and others); PARTNO: APTD1608CGCK
LED705 = pixhawk2:LED: LEDs Standard schematic elements and footprints for 5mm, 3mm, 1206, and 0603 sized LEDs. 5mm - Spark Fun Electronics SKU : COM-00529 (and others); PARTNO: APTD1608QBC/D
M3_MOUNT1101-M3_MOUNT1104 = pixhawk2:MOUNT-HOLE; BOM: EXCLUDE; PARTNO: *
OSHW_LOGO = pixhawk2:OSHW-LOGO: Open Source Hardware Logo This logo indicates the piece of hardware it is found on incorporates a OSHW license and/or adheres to the definition of open source hardware found here: http://freedomdefined.org/OSHW; BOM: EXCLUDE; PARTNO: *
Q601 = transistor-pnp:MMBT3906*: PNP Transistror; PARTNO: MMBT 3906 LT1
R3 R4 R707-R709 R711 R712 R803 R804 R902-R917 = pixhawk2:RESISTOR: Resistor Basic schematic elements and footprints for 0603, 1206, and PTH 1/10th watt (small) resistors.; PARTNO: RC0402FR-07220RL
R101 = pixhawk2:RESISTOR: Resistor Basic schematic elements and footprints for 0603, 1206, and PTH 1/10th watt (small) resistors.; PARTNO: RC0402FR-07470RL
R102 R611 R615 R635 R702 R704 R801 R802 R901 R1002 = pixhawk2:RESISTOR: Resistor Basic schematic elements and footprints for 0603, 1206, and PTH 1/10th watt (small) resistors.; PARTNO: RC0402FR-0710KL
R201-R216 R404 R405 R409 = pixhawk2:RESISTOR: Resistor Basic schematic elements and footprints for 0603, 1206, and PTH 1/10th watt (small) resistors.; PARTNO: RC0402FR-07120RL
R301-R305 R703 R1001 = pixhawk2:RESISTOR: Resistor Basic schematic elements and footprints for 0603, 1206, and PTH 1/10th watt (small) resistors.; PARTNO: RC0402FR-07100KL
R306 R307 R401 R402 R713 = pixhawk2:RESISTOR: Resistor Basic schematic elements and footprints for 0603, 1206, and PTH 1/10th watt (small) resistors.; PARTNO: RC0402FR-071K5L
R403 R406-R408 R609 R610 R918 R919 R922 R1101 R1102 = pixhawk2:RESISTOR: Resistor Basic schematic elements and footprints for 0603, 1206, and PTH 1/10th watt (small) resistors.; PARTNO: ERA-2AEB103X
R602 R604 R1103 R1104 = pixhawk2:RESISTOR: Resistor Basic schematic elements and footprints for 0603, 1206, and PTH 1/10th watt (small) resistors.; PARTNO: RC0402FR-071ML
R603 = pixhawk2:RESISTOR: Resistor Basic schematic elements and footprints for 0603, 1206, and PTH 1/10th watt (small) resistors.; BOM: EXCLUDE; PARTNO: RC0402FR-0710KL
R608 = pixhawk2:RESISTOR: Resistor Basic schematic elements and footprints for 0603, 1206, and PTH 1/10th watt (small) resistors.; PARTNO: RC0402FR-071KL
R616 = pixhawk2:RESISTOR: Resistor Basic schematic elements and footprints for 0603, 1206, and PTH 1/10th watt (small) resistors.; PARTNO: RMCF0402FT25K5
R617 R706 = pixhawk2:RESISTOR: Resistor Basic schematic elements and footprints for 0603, 1206, and PTH 1/10th watt (small) resistors.; PARTNO: RMCF0402FT16K5
R620 = pixhawk2:RESISTOR: Resistor Basic schematic elements and footprints for 0603, 1206, and PTH 1/10th watt (small) resistors.; PARTNO: RC1005F182CS
R621 = pixhawk2:RESISTOR: Resistor Basic schematic elements and footprints for 0603, 1206, and PTH 1/10th watt (small) resistors.; PARTNO: RC1608J100CS
R701 = pixhawk2:RESISTOR: Resistor Basic schematic elements and footprints for 0603, 1206, and PTH 1/10th watt (small) resistors.; PARTNO: RMCF0402FT9K09
R705 R1105 R1109 R1112 = pixhawk2:RESISTOR: Resistor Basic schematic elements and footprints for 0603, 1206, and PTH 1/10th watt (small) resistors.; PARTNO: RMCF0402FT453K
R710 = pixhawk2:RESISTOR: Resistor Basic schematic elements and footprints for 0603, 1206, and PTH 1/10th watt (small) resistors.; PARTNO: ERJ-2GEJ680X
R1106 R1110 R1113 = pixhawk2:RESISTOR: Resistor Basic schematic elements and footprints for 0603, 1206, and PTH 1/10th watt (small) resistors.; PARTNO: ERA-2AEB563X
R1107 R1111 R1114 = pixhawk2:RESISTOR: Resistor Basic schematic elements and footprints for 0603, 1206, and PTH 1/10th watt (small) resistors.; PARTNO: ERJ-2RKF1053X
R1115 = pixhawk2:RESISTOR: Resistor Basic schematic elements and footprints for 0603, 1206, and PTH 1/10th watt (small) resistors.; PARTNO: ERJ-2GE0R00X
RN1101 = resistor-dil:4R-N: Array Chip Resistor Source: RS Component / Phycomp; OC_FARNELL: unknown; OC_NEWARK: unknown; PARTNO: EXB-28V105JX
S601 S801 = pixhawk2:SWITCH-MOMENTARY-2; PARTNO: EVQP7J01K
U101 = pixhawk2:STM32F4X7VX: STM32F4X7VX 100 pin LQFP STM32F407VE - 512 KB flash, no crypto STM32F407VG - 1 MB flash, no crypto STM32F417VE - 512 KB flash, with crypto STM32F417VG - 1 MB flash, with crypto; PARTNO: STM32F427VI
U102 = pixhawk2:FM25V01: FM25V01 128Kb Serial 3V F-RAM Memory; DATASHEET: http://www.ramtron.com/files/datasheets/FM25V01_ds.pdf; LINK: http://www.digikey.com/product-detail/en/FM25V01-GTR/1140-1026-1-ND/2809832; MFGPN: FM25V01; PARTNO: FM25V01-G
U201 U202 U901 U902 = pixhawk2:TXS0108; PARTNO: TXS0108ERGYR
U301 = baseboard:MICROSDSDI; PARTNO: 2908-05WB-MG
U302 = pixhawk2:NUF2042XV6; PARTNO: NUF2042XV6T1G
U401 = pixhawk2:MAX3051: 3.3-V CAN TRANSCEIVER; PARTNO: MAX3051EKA
U501 = pixhawk2:L3G4200DH: L3G4200DH - Digital 3-axis Gyroscope The L3G4200DH is a low-power three-axis angular rate sensor. The L3G4200DH has a full scale of ±250/±500/ ±2000 dps and is capable of measuring rates with a user-selectable bandwidth. It can operate within a temperature range from -40 °C to +85 °C. Supply voltage: 2.4 V to 3.6 V. Full datasheet: L3G4200DH Datasheet <http://www.st.com/stonline/products/literature/ds/17300.pdf>; PARTNO: L3GD20
U502 = pixhawk2:L3GD20H: L3GD20H MEMS motion sensor: 3-axis digital output gyroscope; BOM: EXCLUDE; DATASHEET: http://www.st.com/internet/com/TECHNICAL_RESOURCES/TECHNICAL_LITERATURE/DATASHEET/DM00060659.pdf; LINK: http://www.st.com/internet/analog/product/254039.jsp; MFGPN: L3GD20H; PARTNO: L3GD20H
U504 = pixhawk2:LSM303D: LSM303D Ultra compact high performance e-compass: 3D accelerometer and 3D magnetometer module; DATASHEET: http://www.st.com/internet/com/TECHNICAL_RESOURCES/TECHNICAL_LITERATURE/DATASHEET/DM00057547.pdf; LINK: http://www.st.com/internet/analog/product/253884.jsp; MFGPN: LSM303D; PARTNO: LSM303D
U505 = pixhawk2:MPU-6000: Invensense MPU-6000: 3-axis gyro, 3-axis accel & 9-axis MotionFusion The MPU-60X0 Motion Processing Unit (MPU?) is the world?s first motion processing solution with integrated 9-axis sensor fusion for handset and tablet applications, game controllers, motion pointer remote controls, and other consumer devices. The MPU-60X0 has an embedded 3-axis MEMS gyroscope, 3-axis MEMS accelerometer and Digital Motion Processor? (DMP) hardware accelerator engine with an auxiliary I 2 C port that interfaces to third party digital sensors, such as magnetometers. Interfacing with a 3-axis magnetometer delivers a complete 9-axis sensor fusion output to the MPU?s primary I 2 C or SPI port. (SPI is available on MPU-6000 only). This combines acceleration and rotational motion plus heading information into a single data stream for the application; DATASHEET: http://invensense.com/mems/gyro/documents/PS-MPU-6000A-00_v1.0.pdf; LINK: http://invensense.com/mems/gyro/mpu6000.html; MFGPN: MPU-6000; PARTNO: MPU-6000
U506 = pixhawk2:MS5611-01BA: MS5611-01BA The MS5611-01BA is a new generation of high resolution altimeter sensors from MEAS Switzerland with SPI and I 2 C bus interface. It is optimized for altimeters and variometers with an altitude resolution of 10 cm. The sensor module includes a high linearity pressure sensor and an ultra low power 24 bit ?? ADC with internal factory calibrated coefficients. It provides a precise digital 24 Bit pressure and temperature value and different operation modes that allow the user to optimize for conversion speed and current consumption. A high resolution temperature output allows the implementation of an altimeter/thermometer function without any additional sensor. The MS5611-01BA can be interfaced to virtually any microcontroller. The communication protocol is simple, without the need of programming internal registers in the device. Small dimensions of only 5.0 mm x 3.0 mm and a height of 1.7 mm allow for integration in mobile devices. This new sensor module generation is based on leading MEMS technology and latest benefits from MEAS Switzerland proven experience and know-how in high volume manufacturing of altimeter modules, which have been widely used for over a decade. The sensing principle employed leads to very low hysteresis and high stability of both pressure and temperature signal. High resolution module, 10 cm Fast conversion down to 1 ms Low power, 1 µA (standby < 0.15 µA) QFN package 5.0 x 3.0 x 1.7 mm3 Supply voltage 1.8 to 3.6 V Integrated digital pressure sensor (24 bit ?? ADC) Operating range: 10 to 1200 mbar, -40 to +85 °C I2C and SPI interface up to 20 MHz No external components (Internal oscillator) Excellent long term stability; DATASHEET: http://www.meas-spec.com/downloads/MS5611-01BA01.pdf; LINK: http://www.meas-spec.com/product/t_product.aspx?id=8503#; MFGPN: MS5611-01BA; PARTNO: MS5611-01BA
U601 U602 = pixhawk2:BQ24315; PARTNO: BQ24315DSGR
U603 U1002 = pixhawk2:MIC5332; PARTNO: MIC5332-SSYMT
U701 = pixhawk2:TCA62724FMG: Toshiba TCA62724FMG I2C RGB LED driver; PARTNO: TCA62724FMG
U702 = pixhawk2:LT3469: LT3469 Piezo microactuator driver with boost regulator; PARTNO: LT3469ETS8
U703 = pixhawk2:RGB-LED: RGB LED with separate anode/cathode terminals; PARTNO: LRTB GFTG-T7AW-1+V7A7-29+R5T9-49-L
U801 = pixhawk2:STM32F10XCXT6: ST STM32F101/103 48pin LQFP; PARTNO: STM32F100C8T6B
U903 = pixhawk2:74LVC2G240: Dual inverter tri-state, 3.3V/5V compatible http://www.nxp.com/documents/data_sheet/74LVC2G240.pdf http://focus.ti.com/lit/ds/symlink/sn74lvc2g240.pdf; PARTNO: 74LVC2G240DP,125
U1001 = pixhawk2:BQ24313; PARTNO: BQ24313DSGT
U1101 = pixhawk2:LTC4117; PARTNO: LTC4417IUF#PBF
U1102-U1104 = pixhawk2:MOSFET-DUAL-PCHANNEL; PARTNO: NTHD4102PT1G
X101 X801 = pixhawk2:OSCILLATOR: Crystal Oscillator in 3.2x2.5 SMD; PARTNO: NX3225SA-24.000000MHZ
X503 = pixhawk2:CONN_FPC_10: 10-pin FPC connector for PX4 sensor board; PARTNO: 0781191109

## Net classes
0 signal: width 0.15 mm, drill 0.15 mm, clearance 0.152 mm
1 power: width 0.15 mm, drill 0.2 mm, clearance 0.152 mm